# EAGLE design ControlUnit (EAGLE 5.12)

## Sheet 1 of 5
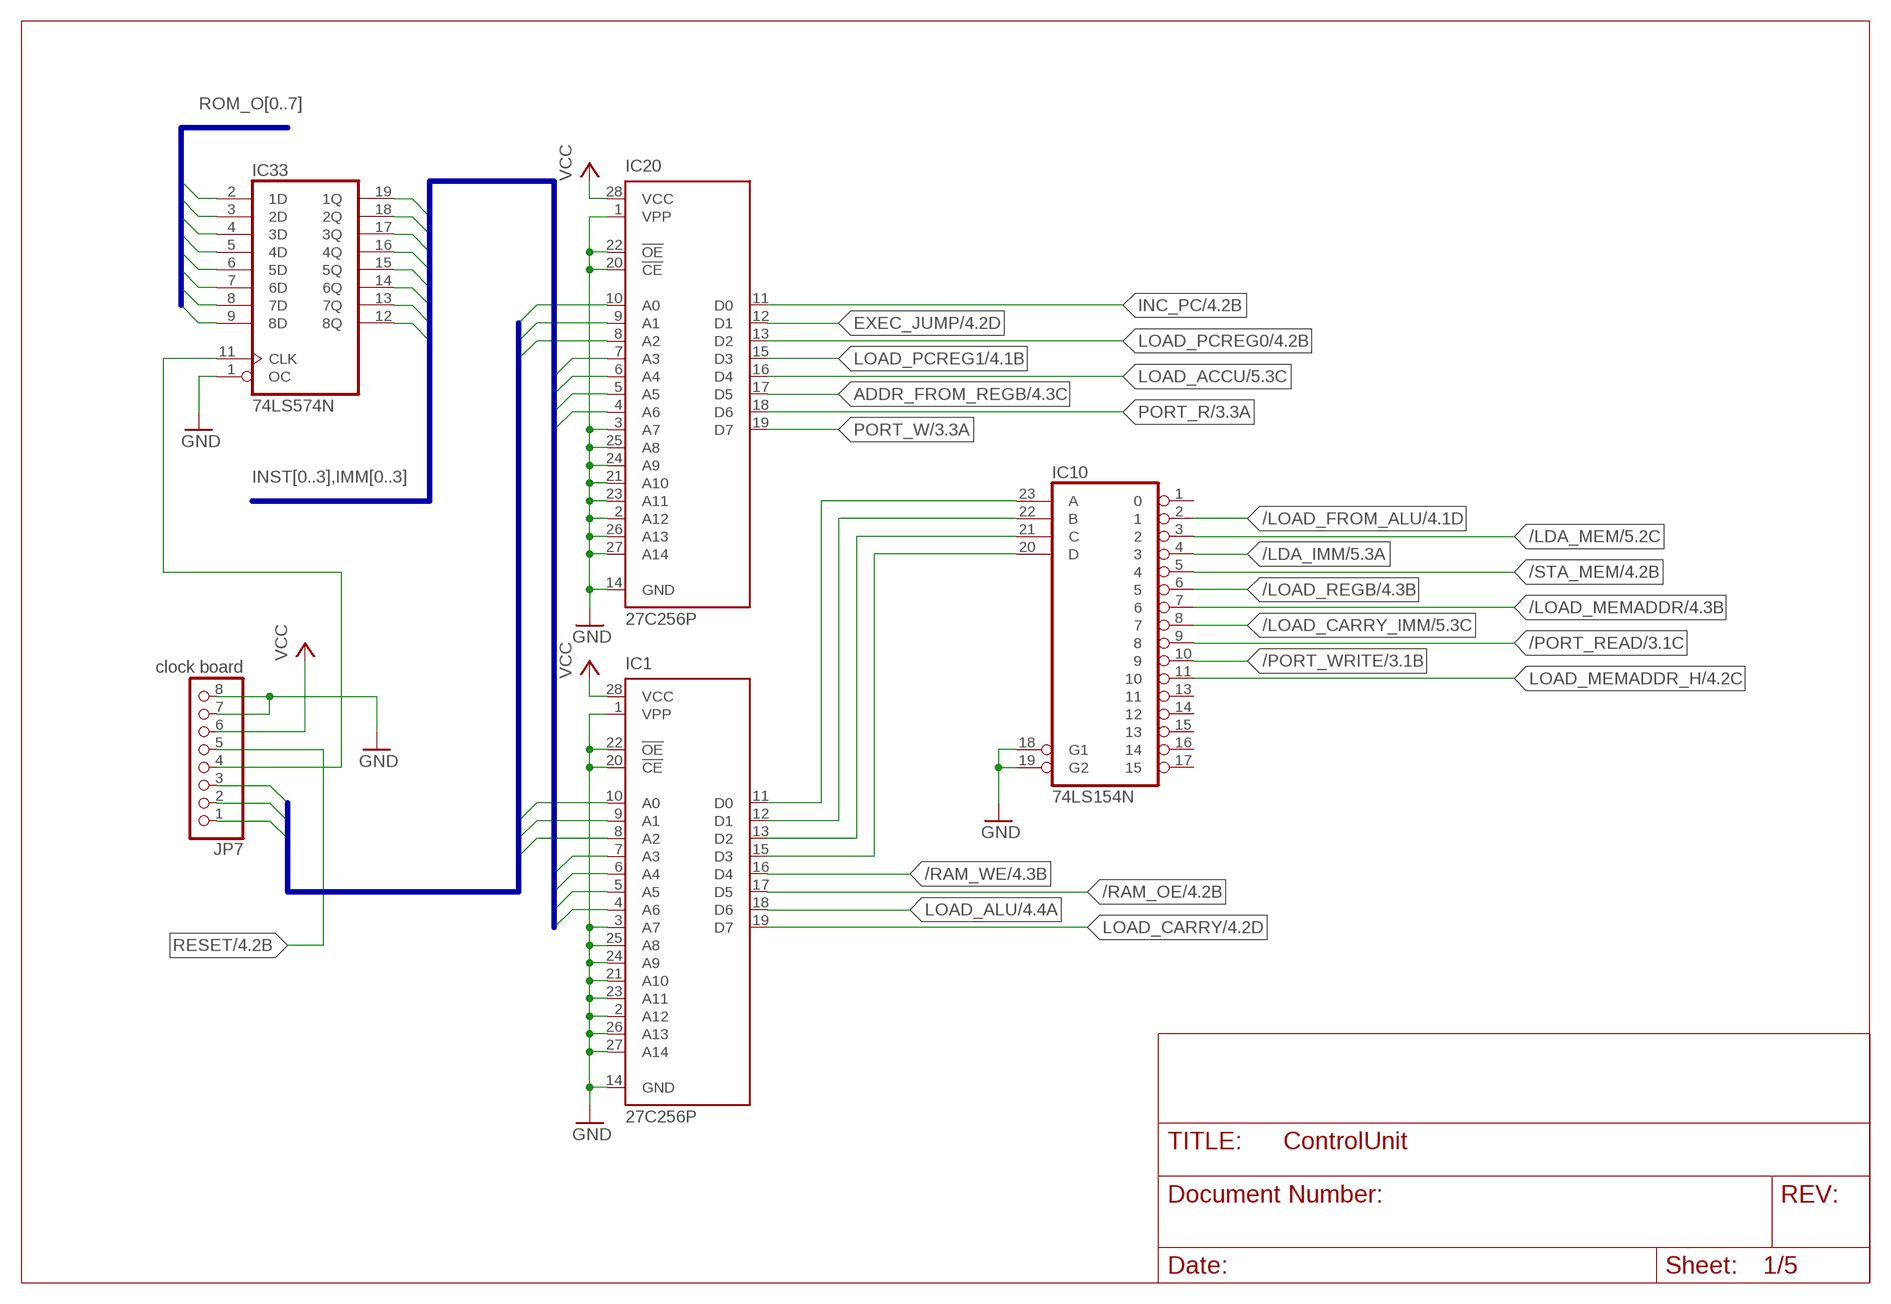
[diagram p0: schematic, sheet 1]

### Parts
IC1  27C256P  [DIL28-6]
IC10  74LS154N  74154N  [DIL24-6]
IC20  27C256P  [DIL28-6]
IC33  74LS574N  74AS574N  [DIL20]
JP7  clock board  PINHD-1X8  [1X08]

### Nets
/LDA_IMM: IC10.4 ; also sheet 5
/LDA_MEM: IC10.3 ; also sheet 5
/LOAD_CARRY_IMM: IC10.8 ; also sheet 5
/LOAD_FROM_ALU: IC10.2 ; also sheet 4,5
/LOAD_MEMADDR: IC10.7 ; also sheet 4
/LOAD_REGB: IC10.6 ; also sheet 4
/PORT_READ: IC10.9 ; also sheet 3
/PORT_WRITE: IC10.10 ; also sheet 3
/RAM_OE: IC1.17(D5) ; also sheet 4
/RAM_WE: IC1.16(D4) ; also sheet 4
/STA_MEM: IC10.5 ; also sheet 4
ADDR_FROM_REGB: IC20.17(D5) ; also sheet 4
EXEC_JUMP: IC20.12(D1) ; also sheet 4
GND: IC1.1(VPP) IC1.2(A12) IC1.3(A7) IC1.14(GND) IC1.20(!CE) IC1.21(A10) IC1.22(!OE) IC1.23(A11) IC1.24(A9) IC1.25(A8) IC1.26(A13) IC1.27(A14) IC10.18(G1) IC10.19(G2) IC20.1(VPP) IC20.2(A12) IC20.3(A7) IC20.14(GND) IC20.20(!CE) IC20.21(A10) IC20.22(!OE) IC20.23(A11) IC20.24(A9) IC20.25(A8) IC20.26(A13) IC20.27(A14) IC33.1(OC) JP7.7 JP7.8 ; also sheet 2,3,4,5
IC0: IC1.10(A0) IC20.10(A0) JP7.1
IC1: IC1.9(A1) IC20.9(A1) JP7.2
IC2: IC1.8(A2) IC20.8(A2) JP7.3
IMM0: IC33.15(5Q) ; also sheet 3,4,5
IMM1: IC33.14(6Q) ; also sheet 3,4,5
IMM2: IC33.13(7Q) ; also sheet 3,4,5
IMM3: IC33.12(8Q) ; also sheet 3,4,5
INC_PC: IC20.11(D0) ; also sheet 4
INST0: IC1.7(A3) IC20.7(A3) IC33.19(1Q)
INST1: IC1.6(A4) IC20.6(A4) IC33.18(2Q)
INST2: IC1.5(A5) IC20.5(A5) IC33.17(3Q)
INST3: IC1.4(A6) IC20.4(A6) IC33.16(4Q)
LOAD_ACCU: IC20.16(D4) ; also sheet 5
LOAD_ALU: IC1.18(D6) ; also sheet 4
LOAD_CARRY: IC1.19(D7) ; also sheet 4
LOAD_INST: IC33.11(CLK) JP7.4
LOAD_MEMADDR_H: IC10.11 ; also sheet 4
LOAD_PCREG0: IC20.13(D2) ; also sheet 4
LOAD_PCREG1: IC20.15(D3) ; also sheet 4
LOADREG0: IC1.11(D0) IC10.23(A)
LOADREG1: IC1.12(D1) IC10.22(B)
LOADREG2: IC1.13(D2) IC10.21(C)
LOADREG3: IC1.15(D3) IC10.20(D)
PORT_R: IC20.18(D6) ; also sheet 3
PORT_W: IC20.19(D7) ; also sheet 3
RESET: JP7.5 ; also sheet 4
ROM_O0: IC33.2(1D) ; also sheet 4
ROM_O1: IC33.3(2D) ; also sheet 4
ROM_O2: IC33.4(3D) ; also sheet 4
ROM_O3: IC33.5(4D) ; also sheet 4
ROM_O4: IC33.6(5D) ; also sheet 4
ROM_O5: IC33.7(6D) ; also sheet 4
ROM_O6: IC33.8(7D) ; also sheet 4
ROM_O7: IC33.9(8D) ; also sheet 4
VCC: IC1.28(VCC) IC20.28(VCC) JP7.6 ; also sheet 2,3,4
Unconnected: IC10.1 IC10.13 IC10.14 IC10.15 IC10.16 IC10.17

### Buses
ROM_O[0..7]
INST[0..3],IMM[0..3]
IC[0..2]

## Sheet 2 of 5
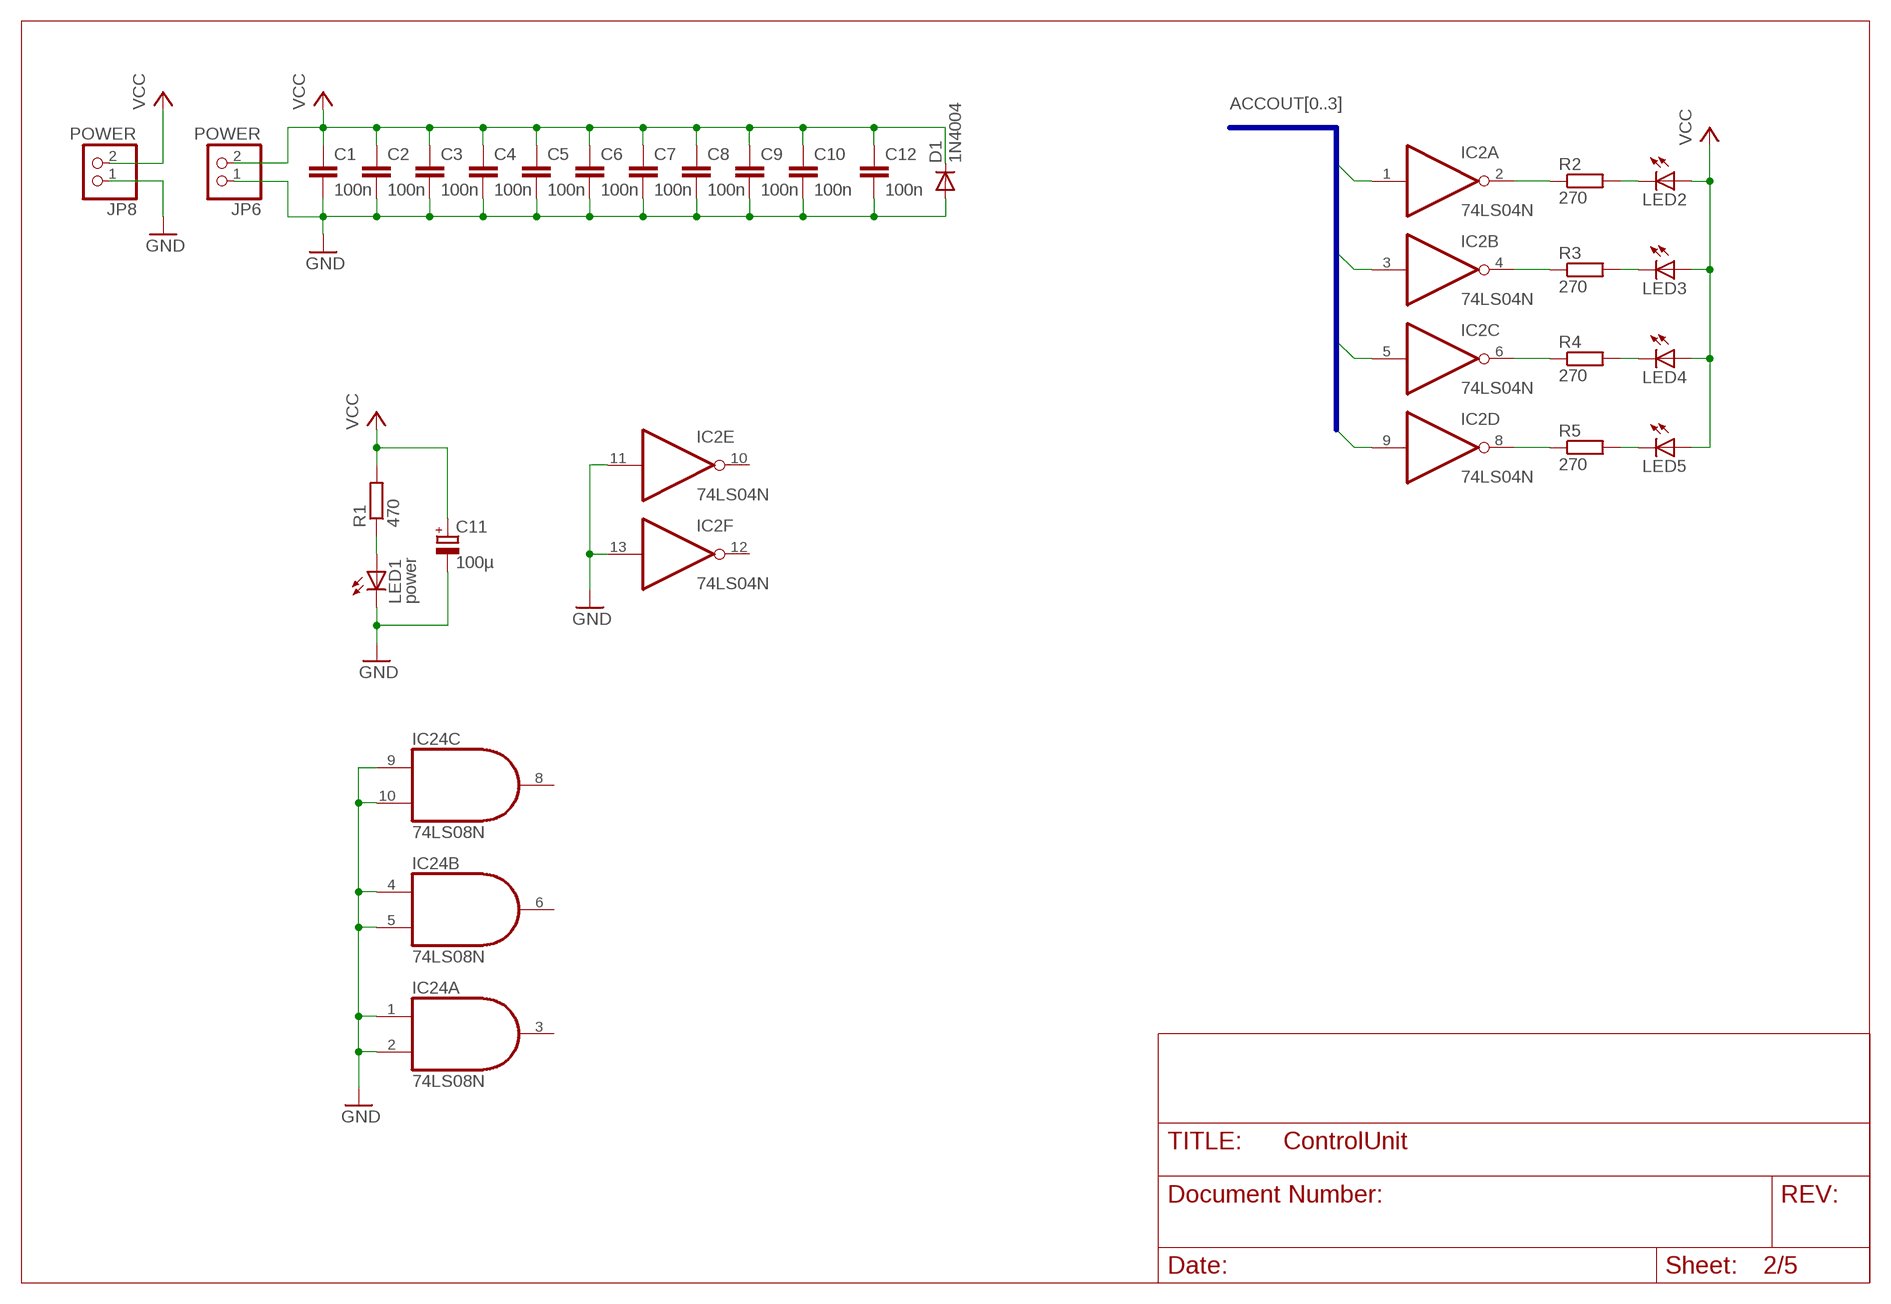
[diagram p1: schematic, sheet 2]

### Parts
C1  100n  C-EU050-025X075  [C050-025X075]
C2  100n  C-EU050-025X075  [C050-025X075]
C3  100n  C-EU050-025X075  [C050-025X075]
C4  100n  C-EU050-025X075  [C050-025X075]
C5  100n  C-EU050-025X075  [C050-025X075]
C6  100n  C-EU050-025X075  [C050-025X075]
C7  100n  C-EU050-025X075  [C050-025X075]
C8  100n  C-EU050-025X075  [C050-025X075]
C9  100n  C-EU050-025X075  [C050-025X075]
C10  100n  C-EU050-025X075  [C050-025X075]
C11  100µ  CPOL-EUE2.5-7  [E2,5-7]
C12  100n  C-EU050-025X075  [C050-025X075]
D1  1N4004  [DO41-10]
IC2  74LS04N  [DIL14]
IC24  74LS08N  [DIL14]
JP6  POWER  PINHD-1X2  [1X02]
JP8  POWER  PINHD-1X2  [1X02]
LED1  power  LED5MM  [LED5MM]
LED2  LED5MM  [LED5MM]
LED3  LED5MM  [LED5MM]
LED4  LED5MM  [LED5MM]
LED5  LED5MM  [LED5MM]
R1  470  R-EU_0207/10  [0207/10]
R2  270  R-EU_0207/7  [0207/7]
R3  270  R-EU_0207/7  [0207/7]
R4  270  R-EU_0207/7  [0207/7]
R5  270  R-EU_0207/7  [0207/7]

### Nets
ACCOUT0: IC2.1(A:I) ; also sheet 3,4,5
ACCOUT1: IC2.3(B:I) ; also sheet 3,4,5
ACCOUT2: IC2.5(C:I) ; also sheet 3,4,5
ACCOUT3: IC2.9(D:I) ; also sheet 3,4,5
GND: C1.2 C2.2 C3.2 C4.2 C5.2 C6.2 C7.2 C8.2 C9.2 C10.2 C11.- C12.2 D1.A IC2.11(E:I) IC2.13(F:I) IC24.1(A:I0) IC24.2(A:I1) IC24.4(B:I0) IC24.5(B:I1) IC24.9(C:I0) IC24.10(C:I1) JP6.1 JP8.1 LED1.K(C) ; also sheet 1,3,4,5
N$1: LED1.A R1.1
N$2: IC2.2(A:O) R2.1
N$3: IC2.4(B:O) R3.1
N$4: IC2.6(C:O) R4.1
N$5: IC2.8(D:O) R5.1
N$6: LED2.K(C) R2.2
N$7: LED3.K(C) R3.2
N$8: LED4.K(C) R4.2
N$9: LED5.K(C) R5.2
VCC: C1.1 C2.1 C3.1 C4.1 C5.1 C6.1 C7.1 C8.1 C9.1 C10.1 C11.+ C12.1 D1.C JP6.2 JP8.2 LED2.A LED3.A LED4.A LED5.A R1.2 ; also sheet 1,3,4
Unconnected: IC2.10(E:O) IC2.12(F:O) IC24.3(A:O) IC24.6(B:O) IC24.8(C:O)

### Buses
ACCOUT[0..3]

## Sheet 3 of 5
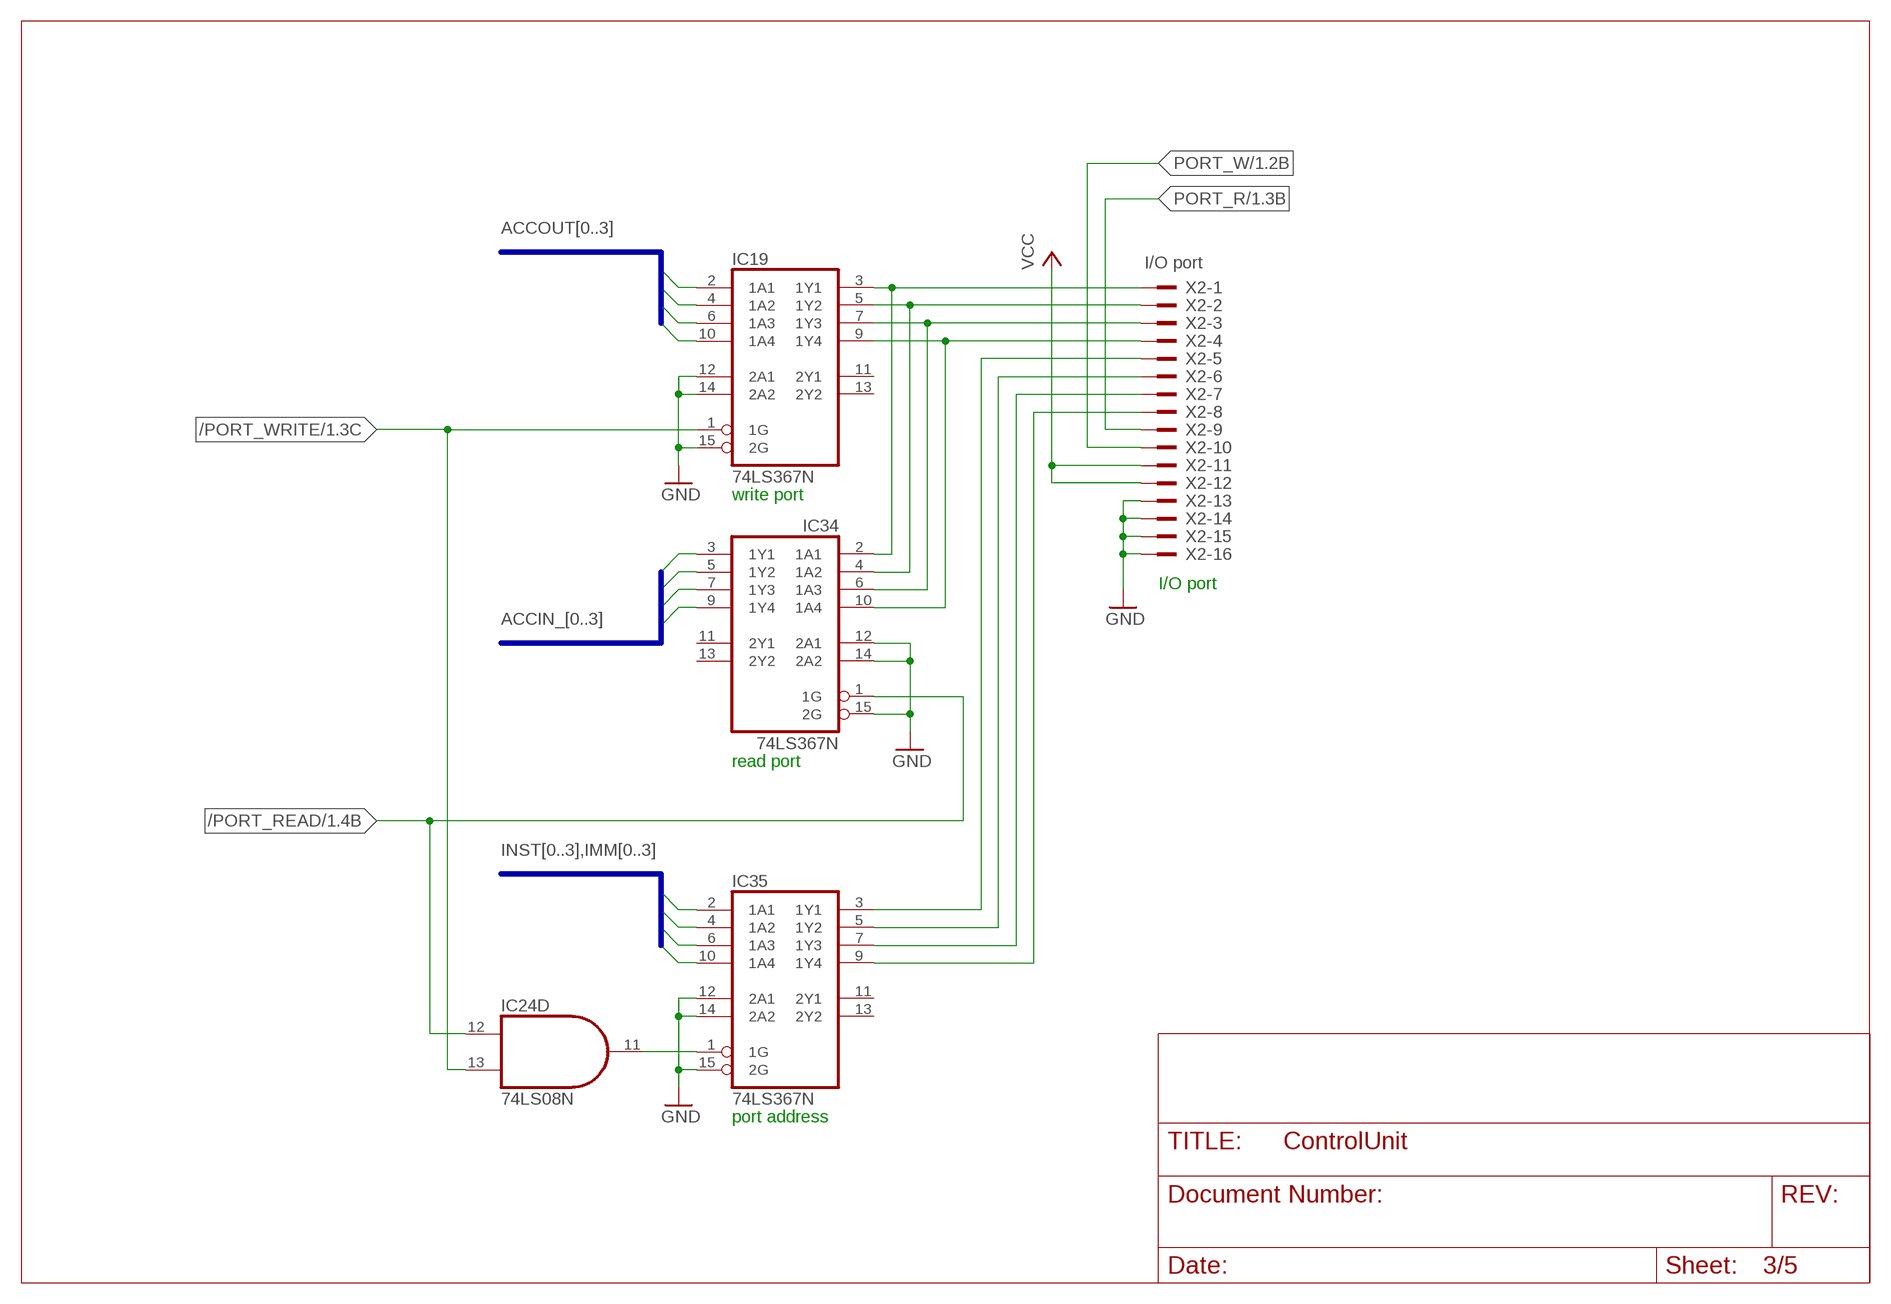
[diagram p2: schematic, sheet 3]

### Parts
IC19  74LS367N  74367N  [DIL16]
IC34  74LS367N  74367N  [DIL16]
IC35  74LS367N  74367N  [DIL16]
X2  I/O port  2516-  [PAK100/2500-16]

### Nets
/EN_PORT_ADDR: IC24.11(D:O) IC35.1(1G)
/PORT_READ: IC24.12(D:I0) IC34.1(1G) ; also sheet 1
/PORT_WRITE: IC19.1(1G) IC24.13(D:I1) ; also sheet 1
ACCIN_0: IC34.3(1Y1) ; also sheet 5
ACCIN_1: IC34.5(1Y2) ; also sheet 5
ACCIN_2: IC34.7(1Y3) ; also sheet 5
ACCIN_3: IC34.9(1Y4) ; also sheet 5
ACCOUT0: IC19.2(1A1) ; also sheet 2,4,5
ACCOUT1: IC19.4(1A2) ; also sheet 2,4,5
ACCOUT2: IC19.6(1A3) ; also sheet 2,4,5
ACCOUT3: IC19.10(1A4) ; also sheet 2,4,5
GND: IC19.12(2A1) IC19.14(2A2) IC19.15(2G) IC34.12(2A1) IC34.14(2A2) IC34.15(2G) IC35.12(2A1) IC35.14(2A2) IC35.15(2G) X2.13 X2.14 X2.15 X2.16 ; also sheet 1,2,4,5
IMM0: IC35.2(1A1) ; also sheet 1,4,5
IMM1: IC35.4(1A2) ; also sheet 1,4,5
IMM2: IC35.6(1A3) ; also sheet 1,4,5
IMM3: IC35.10(1A4) ; also sheet 1,4,5
PORT_ADDR0: IC35.3(1Y1) X2.5
PORT_ADDR1: IC35.5(1Y2) X2.6
PORT_ADDR2: IC35.7(1Y3) X2.7
PORT_ADDR3: IC35.9(1Y4) X2.8
PORT_IO0: IC19.3(1Y1) IC34.2(1A1) X2.1
PORT_IO1: IC19.5(1Y2) IC34.4(1A2) X2.2
PORT_IO2: IC19.7(1Y3) IC34.6(1A3) X2.3
PORT_IO3: IC19.9(1Y4) IC34.10(1A4) X2.4
PORT_R: X2.9 ; also sheet 1
PORT_W: X2.10 ; also sheet 1
VCC: X2.11 X2.12 ; also sheet 1,2,4
Unconnected: IC19.11(2Y1) IC19.13(2Y2) IC34.11(2Y1) IC34.13(2Y2) IC35.11(2Y1) IC35.13(2Y2)

### Buses
ACCIN_[0..3]
INST[0..3],IMM[0..3]
ACCOUT[0..3]

### Notes on the sheet
- write port
- I/O port
- read port
- port address

## Sheet 4 of 5
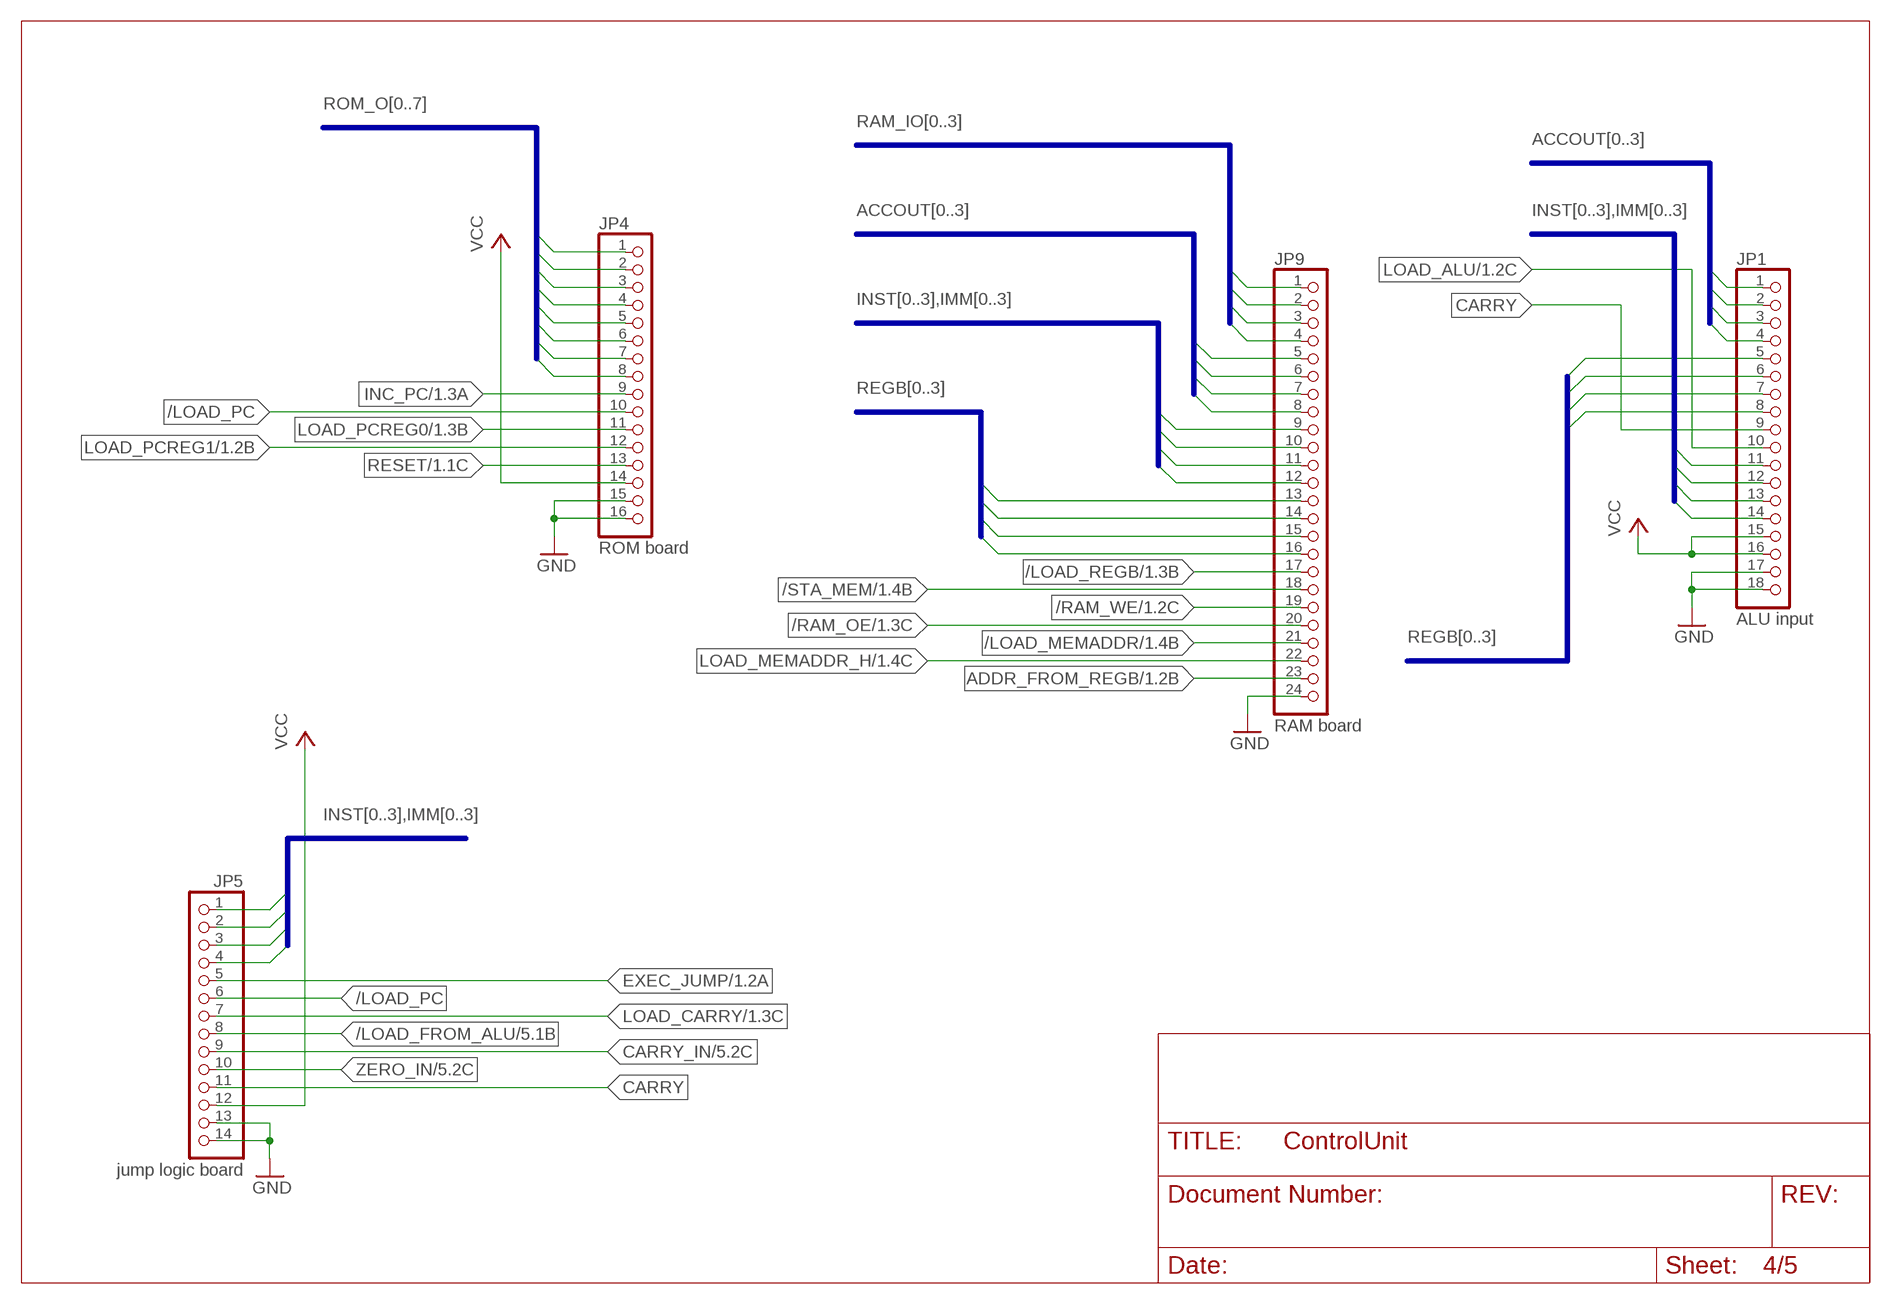
[diagram p3: schematic, sheet 4]

### Parts
JP1  ALU input  PINHD-1X18  [1X18]
JP4  ROM board  PINHD-1X16  [1X16]
JP5  jump logic board  PINHD-1X14  [1X14]
JP9  RAM board  PINHD-1X24  [1X24]

### Nets
/LOAD_FROM_ALU: JP5.8 ; also sheet 1,5
/LOAD_MEMADDR: JP9.21 ; also sheet 1
/LOAD_PC: JP4.10 JP5.6
/LOAD_REGB: JP9.17 ; also sheet 1
/RAM_OE: JP9.20 ; also sheet 1
/RAM_WE: JP9.19 ; also sheet 1
/STA_MEM: JP9.18 ; also sheet 1
ACCOUT0: JP1.1 JP9.5 ; also sheet 2,3,5
ACCOUT1: JP1.2 JP9.6 ; also sheet 2,3,5
ACCOUT2: JP1.3 JP9.7 ; also sheet 2,3,5
ACCOUT3: JP1.4 JP9.8 ; also sheet 2,3,5
ADDR_FROM_REGB: JP9.23 ; also sheet 1
CARRY: JP1.9 JP5.11
CARRY_IN: JP5.9 ; also sheet 5
EXEC_JUMP: JP5.5 ; also sheet 1
GND: JP1.17 JP1.18 JP4.15 JP4.16 JP5.13 JP5.14 JP9.24 ; also sheet 1,2,3,5
IMM0: JP1.11 JP5.4 JP9.9 ; also sheet 1,3,5
IMM1: JP1.12 JP5.3 JP9.10 ; also sheet 1,3,5
IMM2: JP1.13 JP5.2 JP9.11 ; also sheet 1,3,5
IMM3: JP1.14 JP5.1 JP9.12 ; also sheet 1,3,5
INC_PC: JP4.9 ; also sheet 1
LOAD_ALU: JP1.10 ; also sheet 1
LOAD_CARRY: JP5.7 ; also sheet 1
LOAD_MEMADDR_H: JP9.22 ; also sheet 1
LOAD_PCREG0: JP4.11 ; also sheet 1
LOAD_PCREG1: JP4.12 ; also sheet 1
RAM_IO0: JP9.1 ; also sheet 5
RAM_IO1: JP9.2 ; also sheet 5
RAM_IO2: JP9.3 ; also sheet 5
RAM_IO3: JP9.4 ; also sheet 5
REGB0: JP1.5 JP9.13
REGB1: JP1.6 JP9.14
REGB2: JP1.7 JP9.15
REGB3: JP1.8 JP9.16
RESET: JP4.13 ; also sheet 1
ROM_O0: JP4.1 ; also sheet 1
ROM_O1: JP4.2 ; also sheet 1
ROM_O2: JP4.3 ; also sheet 1
ROM_O3: JP4.4 ; also sheet 1
ROM_O4: JP4.5 ; also sheet 1
ROM_O5: JP4.6 ; also sheet 1
ROM_O6: JP4.7 ; also sheet 1
ROM_O7: JP4.8 ; also sheet 1
VCC: JP1.15 JP1.16 JP4.14 JP5.12 ; also sheet 1,2,3
ZERO_IN: JP5.10 ; also sheet 5

### Buses
INST[0..3],IMM[0..3]
ACCOUT[0..3]
REGB[0..3]
RAM_IO[0..3]
ROM_O[0..7]

## Sheet 5 of 5
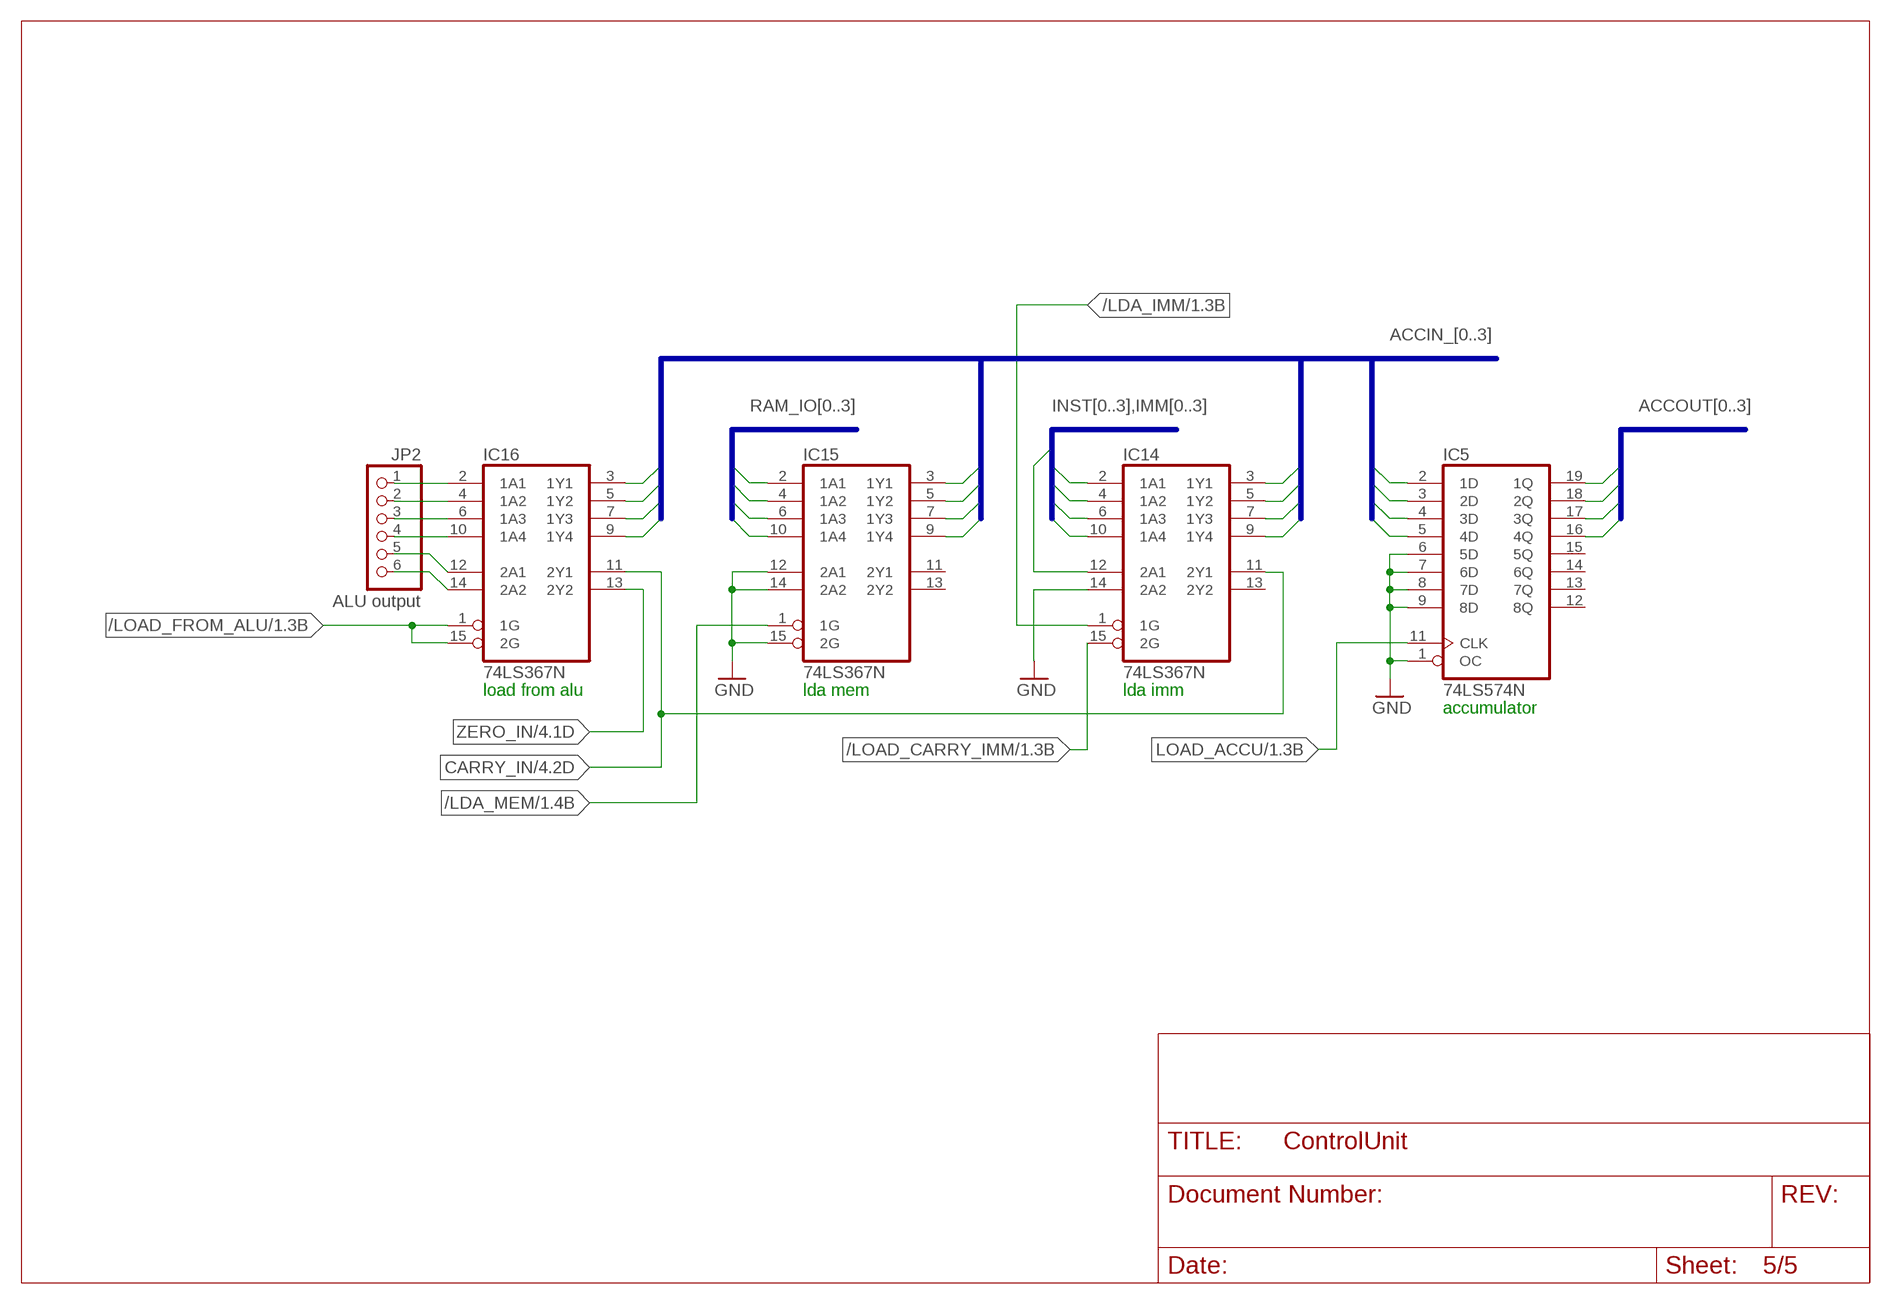
[diagram p4: schematic, sheet 5]

### Parts
IC5  74LS574N  74AS574N  [DIL20]
IC14  74LS367N  74367N  [DIL16]
IC15  74LS367N  74367N  [DIL16]
IC16  74LS367N  74367N  [DIL16]
JP2  ALU output  PINHD-1X6  [1X06]

### Nets
/LDA_IMM: IC14.1(1G) ; also sheet 1
/LDA_MEM: IC15.1(1G) ; also sheet 1
/LOAD_CARRY_IMM: IC14.15(2G) ; also sheet 1
/LOAD_FROM_ALU: IC16.1(1G) IC16.15(2G) ; also sheet 1,4
ACCIN_0: IC5.2(1D) IC14.3(1Y1) IC15.3(1Y1) IC16.3(1Y1) ; also sheet 3
ACCIN_1: IC5.3(2D) IC14.5(1Y2) IC15.5(1Y2) IC16.5(1Y2) ; also sheet 3
ACCIN_2: IC5.4(3D) IC14.7(1Y3) IC15.7(1Y3) IC16.7(1Y3) ; also sheet 3
ACCIN_3: IC5.5(4D) IC14.9(1Y4) IC15.9(1Y4) IC16.9(1Y4) ; also sheet 3
ACCOUT0: IC5.19(1Q) ; also sheet 2,3,4
ACCOUT1: IC5.18(2Q) ; also sheet 2,3,4
ACCOUT2: IC5.17(3Q) ; also sheet 2,3,4
ACCOUT3: IC5.16(4Q) ; also sheet 2,3,4
ALU_CARRY: IC16.12(2A1) JP2.5
ALU_O0: IC16.2(1A1) JP2.1
ALU_O1: IC16.4(1A2) JP2.2
ALU_O2: IC16.6(1A3) JP2.3
ALU_O3: IC16.10(1A4) JP2.4
ALU_ZERO: IC16.14(2A2) JP2.6
CARRY_IN: IC14.11(2Y1) IC16.11(2Y1) ; also sheet 4
GND: IC5.1(OC) IC5.6(5D) IC5.7(6D) IC5.8(7D) IC5.9(8D) IC14.14(2A2) IC15.12(2A1) IC15.14(2A2) IC15.15(2G) ; also sheet 1,2,3,4
IMM0: IC14.2(1A1) IC14.12(2A1) ; also sheet 1,3,4
IMM1: IC14.4(1A2) ; also sheet 1,3,4
IMM2: IC14.6(1A3) ; also sheet 1,3,4
IMM3: IC14.10(1A4) ; also sheet 1,3,4
LOAD_ACCU: IC5.11(CLK) ; also sheet 1
RAM_IO0: IC15.2(1A1) ; also sheet 4
RAM_IO1: IC15.4(1A2) ; also sheet 4
RAM_IO2: IC15.6(1A3) ; also sheet 4
RAM_IO3: IC15.10(1A4) ; also sheet 4
ZERO_IN: IC16.13(2Y2) ; also sheet 4
Unconnected: IC5.12(8Q) IC5.13(7Q) IC5.14(6Q) IC5.15(5Q) IC14.13(2Y2) IC15.11(2Y1) IC15.13(2Y2)

### Buses
ACCIN_[0..3]
RAM_IO[0..3]
ACCOUT[0..3]
INST[0..3],IMM[0..3]

### Notes on the sheet
- load from alu | lda mem | lda imm
- accumulator

## Power pins joined to a net without a drawn wire
GND: IC2.7(P:GND) IC5.10(GND) IC10.12(GND) IC14.8(GND) IC15.8(GND) IC16.8(GND) IC19.8(GND) IC24.7(P:GND) IC33.10(GND) IC34.8(GND) IC35.8(GND)
VCC: IC2.14(P:VCC) IC5.20(VCC) IC10.24(VCC) IC14.16(VCC) IC15.16(VCC) IC16.16(VCC) IC19.16(VCC) IC24.14(P:VCC) IC33.20(VCC) IC34.16(VCC) IC35.16(VCC)

## Library data of the parts
C1-C10 C12 = rcl:C-EU: CAPACITOR, European symbol
C11 = rcl:CPOL-EU: POLARIZED CAPACITOR, European symbol
D1 = diode:1N4004: DIODE general purpose rectifier, 1 A
IC1 IC20 = microchip:27*256: CMOS EPROM 256 K (32 K x 8), low voltage; MF: Arrow Electronics; MPN: M27C256B15F1; OC_FARNELL: 1125431; OC_NEWARK: 93K7335
IC2 = 74xx-eu:74*04: Hex INVERTER
IC5 IC33 = 74xx-us:74*574: 8-bit D type FLIP FLOP bus driver
IC10 = 74xx-us:74*154: 4-line to 16-line data SELECTOR/MULTIPLEXER
IC14-IC16 IC19 IC34 IC35 = 74xx-us:74*367: Hex BUS DRIVER, 3-state
IC24 = 74xx-us:74*08: Quad 2-input AND gate
JP1 = pinhead:PINHD-1X18: PIN HEADER
JP2 = pinhead:PINHD-1X6: PIN HEADER
JP4 = pinhead:PINHD-1X16: PIN HEADER
JP5 = pinhead:PINHD-1X14: PIN HEADER
JP6 JP8 = pinhead:PINHD-1X2: PIN HEADER
JP7 = pinhead:PINHD-1X8: PIN HEADER
JP9 = pinhead:PINHD-1X24: PIN HEADER
LED1-LED5 = led:LED: LED OSRAM: - CHIPLED LG R971, LG N971, LY N971, LG Q971, LY Q971, LO R971, LY R971 LH N974, LH R974 LS Q976, LO Q976, LY Q976 LO Q996 - Hyper CHIPLED LW Q18S LB Q993, LB Q99A, LB R99A - SideLED LS A670, LO A670, LY A670, LG A670, LP A670 LB A673, LV A673, LT A673, LW A673 LH A674 LY A675 LS A676, LA A676, LO A676, LY A676, LW A676 LS A679, LY A679, LG A679 - Hyper Micro SIDELED® LS Y876, LA Y876, LO Y876, LY Y876 LT Y87S - SmartLED LW L88C, LW L88S LB L89C, LB L89S, LG L890 LS L89K, LO L89K, LY L89K LS L896, LA L896, LO L896, LY L896 - TOPLED LS T670, LO T670, LY T670, LG T670, LP T670 LSG T670, LSP T670, LSY T670, LOP T670, LYG T670 LG T671, LOG T671, LSG T671 LB T673, LV T673, LT T673, LW T673 LH T674 LS T676, LA T676, LO T676, LY T676, LB T676, LH T676, LSB T676, LW T676 LB T67C, LV T67C, LT T67C, LS T67K, LO T67K, LY T67K, LW E67C LS E67B, LA E67B, LO E67B, LY E67B, LB E67C, LV E67C, LT E67C LW T67C LS T679, LY T679, LG T679 LS T770, LO T770, LY T770, LG T770, LP T770 LB T773, LV T773, LT T773, LW T773 LH T774 LS E675, LA E675, LY E675, LS T675 LS T776, LA T776, LO T776, LY T776, LB T776 LHGB T686 LT T68C, LB T68C - Hyper Mini TOPLED® LB M676 - Mini TOPLED Santana® LG M470 LS M47K, LO M47K, LY M47K Source: http://www.osram.convergy.de LUXEON: - LUMILED® LXK2-PW12-R00, LXK2-PW12-S00, LXK2-PW14-U00, LXK2-PW14-V00 LXK2-PM12-R00, LXK2-PM12-S00, LXK2-PM14-U00 LXK2-PE12-Q00, LXK2-PE12-R00, LXK2-PE12-S00, LXK2-PE14-T00, LXK2-PE14-U00 LXK2-PB12-K00, LXK2-PB12-L00, LXK2-PB12-M00, LXK2-PB14-N00, LXK2-PB14-P00, LXK2-PB14-Q00 LXK2-PR12-L00, LXK2-PR12-M00, LXK2-PR14-Q00, LXK2-PR14-R00 LXK2-PD12-Q00, LXK2-PD12-R00, LXK2-PD12-S00 LXK2-PH12-R00, LXK2-PH12-S00 LXK2-PL12-P00, LXK2-PL12-Q00, LXK2-PL12-R00 Source: www.luxeon.com KINGBRIGHT: KA-3528ASYC Source: www.kingbright.com
R1-R5 = rcl:R-EU_: RESISTOR, European symbol
X2 = con-3m:2516-: 3M (TM) Pak 100 4-Wall Header Source: 3M; OC_FARNELL: unknown; OC_NEWARK: unknown

## Board
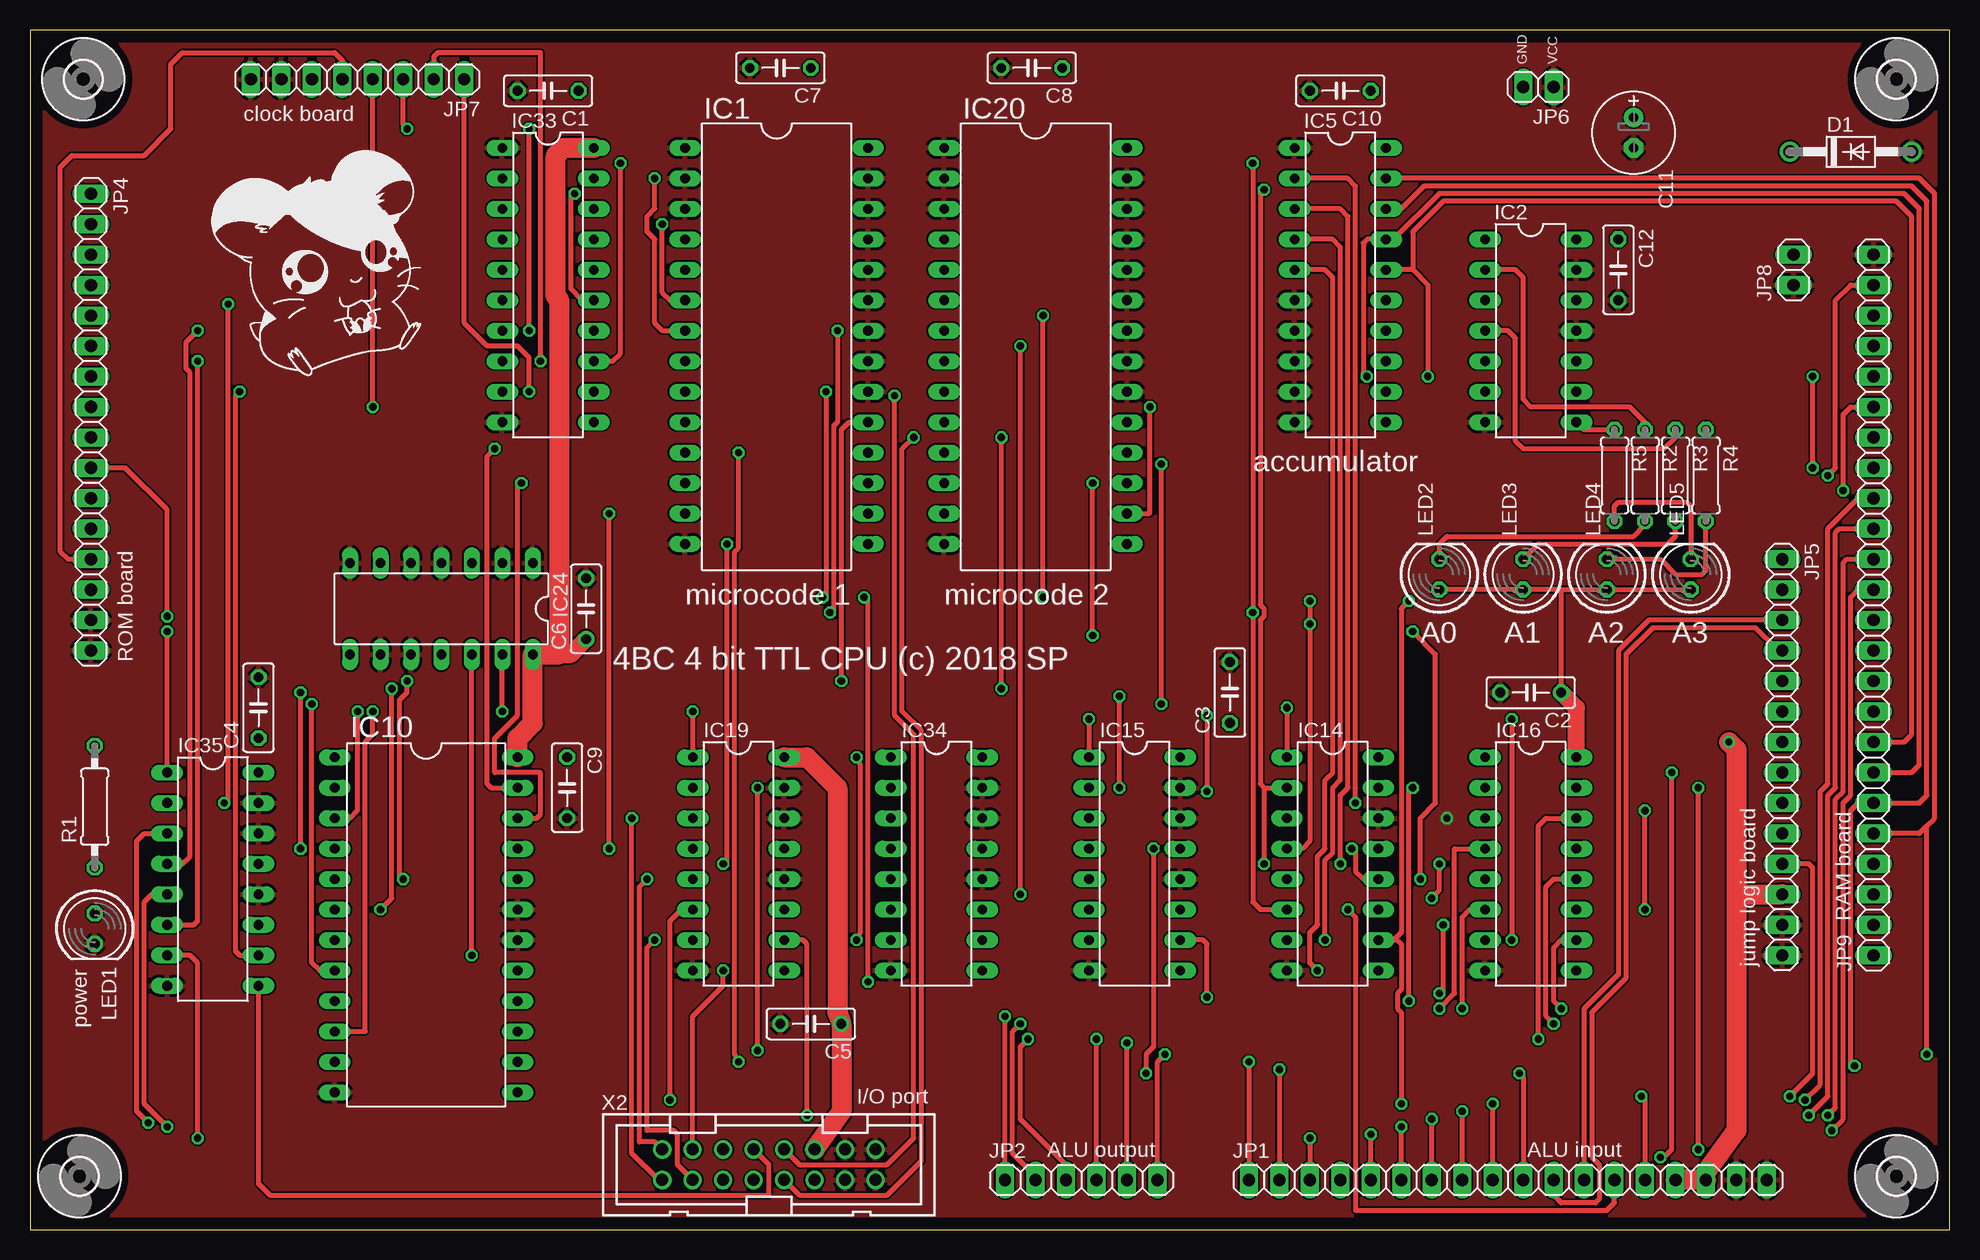
[diagram p5: board, top side]
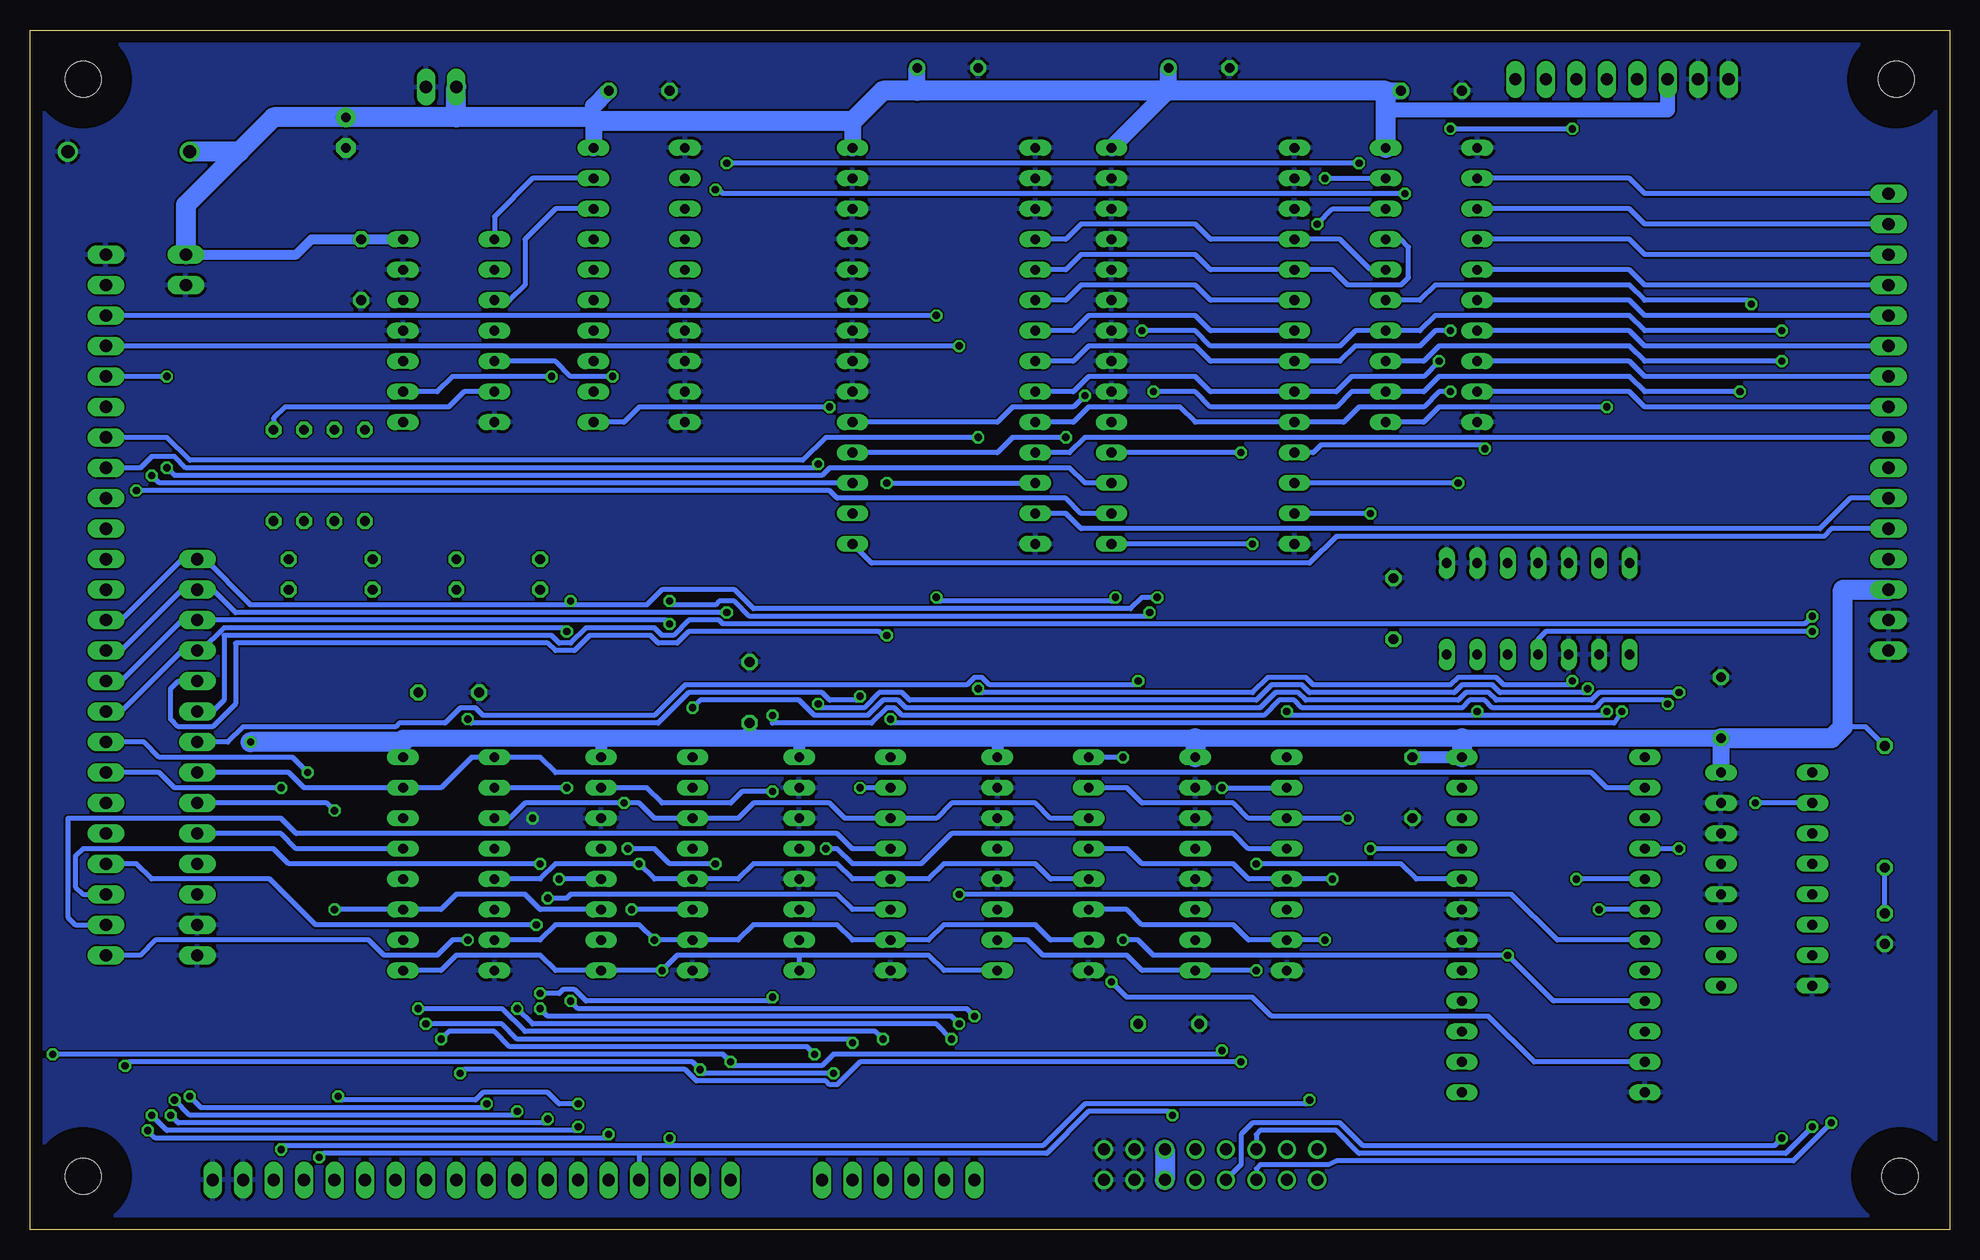
[diagram p6: board, bottom side, seen from below]

Size 160 x 100 mm. Coordinates in mm from the lower left corner, seen from the top.
Outline: 0,0 160,0 160,100 0,100 0,0
Copper layers (1*16): Top 0.035mm / dielectric 1.5mm / Bottom 0.035mm
Design rules "default *": minimum track width 10mil, minimum drill 16mil, track to track 6mil, track to pad 6mil, pad to pad 8mil, via to via 8mil, smd to smd 8mil, copper to edge 40mil, drill to drill 8mil, minimum pad ring 10mil, minimum via ring 8mil, stop-mask expansion 4mil, vias tented up to drill 0mil, thermal gap 10mil

### Footprints (pad centres in the part's own frame; a part is rotated, then mirrored left to right if it is on the bottom)
C050-025X075 = drill 0.813 octagon: 1 -2.54,0; 2 2.54,0
E2,5-7 = drill 0.813 pad 1.6 round: + -1.27,0 | drill 0.813 pad 1.6 octagon: - 1.27,0
DO41-10 = drill 1.118 round: A 5.08,0; C -5.08,0
DIL28-6 = drill 0.813 long: 1 -16.51,-7.62; 2 -13.97,-7.62; 3 -11.43,-7.62; 4 -8.89,-7.62; 5 -6.35,-7.62; 6 -3.81,-7.62; 7 -1.27,-7.62; 8 1.27,-7.62; 9 3.81,-7.62; 10 6.35,-7.62; 11 8.89,-7.62; 12 11.43,-7.62; 13 13.97,-7.62; 14 16.51,-7.62; 15 16.51,7.62; 16 13.97,7.62; 17 11.43,7.62; 18 8.89,7.62; 19 6.35,7.62; 20 3.81,7.62; 21 1.27,7.62; 22 -1.27,7.62; 23 -3.81,7.62; 24 -6.35,7.62; 25 -8.89,7.62; 26 -11.43,7.62; 27 -13.97,7.62; 28 -16.51,7.62
DIL14 = drill 0.813 long: 1 -7.62,-3.81; 2 -5.08,-3.81; 3 -2.54,-3.81; 4 0,-3.81; 5 2.54,-3.81; 6 5.08,-3.81; 7 7.62,-3.81; 8 7.62,3.81; 9 5.08,3.81; 10 2.54,3.81; 11 0,3.81; 12 -2.54,3.81; 13 -5.08,3.81; 14 -7.62,3.81
DIL20 = drill 0.813 long: 1 -11.43,-3.81; 2 -8.89,-3.81; 3 -6.35,-3.81; 4 -3.81,-3.81; 5 -1.27,-3.81; 6 1.27,-3.81; 7 3.81,-3.81; 8 6.35,-3.81; 9 8.89,-3.81; 10 11.43,-3.81; 11 11.43,3.81; 12 8.89,3.81; 13 6.35,3.81; 14 3.81,3.81; 15 1.27,3.81; 16 -1.27,3.81; 17 -3.81,3.81; 18 -6.35,3.81; 19 -8.89,3.81; 20 -11.43,3.81
DIL24-6 = drill 0.813 long: 1 -13.97,-7.62; 2 -11.43,-7.62; 3 -8.89,-7.62; 4 -6.35,-7.62; 5 -3.81,-7.62; 6 -1.27,-7.62; 7 1.27,-7.62; 8 3.81,-7.62; 9 6.35,-7.62; 10 8.89,-7.62; 11 11.43,-7.62; 12 13.97,-7.62; 13 13.97,7.62; 14 11.43,7.62; 15 8.89,7.62; 16 6.35,7.62; 17 3.81,7.62; 18 1.27,7.62; 19 -1.27,7.62; 20 -3.81,7.62; 21 -6.35,7.62; 22 -8.89,7.62; 23 -11.43,7.62; 24 -13.97,7.62
DIL16 = drill 0.813 long: 1 -8.89,-3.81; 2 -6.35,-3.81; 3 -3.81,-3.81; 4 -1.27,-3.81; 5 1.27,-3.81; 6 3.81,-3.81; 7 6.35,-3.81; 8 8.89,-3.81; 9 8.89,3.81; 10 6.35,3.81; 11 3.81,3.81; 12 1.27,3.81; 13 -1.27,3.81; 14 -3.81,3.81; 15 -6.35,3.81; 16 -8.89,3.81
1X18 = drill 1.016 long: 1 -21.59,0; 2 -19.05,0; 3 -16.51,0; 4 -13.97,0; 5 -11.43,0; 6 -8.89,0; 7 -6.35,0; 8 -3.81,0; 9 -1.27,0; 10 1.27,0; 11 3.81,0; 12 6.35,0; 13 8.89,0; 14 11.43,0; 15 13.97,0; 16 16.51,0; 17 19.05,0; 18 21.59,0
1X06 = drill 1.016 long: 1 -6.35,0; 2 -3.81,0; 3 -1.27,0; 4 1.27,0; 5 3.81,0; 6 6.35,0
1X16 = drill 1.016 long: 1 -19.05,0; 2 -16.51,0; 3 -13.97,0; 4 -11.43,0; 5 -8.89,0; 6 -6.35,0; 7 -3.81,0; 8 -1.27,0; 9 1.27,0; 10 3.81,0; 11 6.35,0; 12 8.89,0; 13 11.43,0; 14 13.97,0; 15 16.51,0; 16 19.05,0
1X14 = drill 1.016 long: 1 -16.51,0; 2 -13.97,0; 3 -11.43,0; 4 -8.89,0; 5 -6.35,0; 6 -3.81,0; 7 -1.27,0; 8 1.27,0; 9 3.81,0; 10 6.35,0; 11 8.89,0; 12 11.43,0; 13 13.97,0; 14 16.51,0
1X02 = drill 1.016 long: 1 -1.27,0; 2 1.27,0
1X08 = drill 1.016 long: 1 -8.89,0; 2 -6.35,0; 3 -3.81,0; 4 -1.27,0; 5 1.27,0; 6 3.81,0; 7 6.35,0; 8 8.89,0
1X24 = drill 1.016 long: 1 -29.21,0; 2 -26.67,0; 3 -24.13,0; 4 -21.59,0; 5 -19.05,0; 6 -16.51,0; 7 -13.97,0; 8 -11.43,0; 9 -8.89,0; 10 -6.35,0; 11 -3.81,0; 12 -1.27,0; 13 1.27,0; 14 3.81,0; 15 6.35,0; 16 8.89,0; 17 11.43,0; 18 13.97,0; 19 16.51,0; 20 19.05,0; 21 21.59,0; 22 24.13,0; 23 26.67,0; 24 29.21,0
LED5MM = drill 0.813 octagon: A -1.27,0; K 1.27,0
0207/10 = drill 0.813 octagon: 1 -5.08,0; 2 5.08,0
0207/7 = drill 0.813 octagon: 1 -3.81,0; 2 3.81,0
3,0 = hole 3: 0,0
PAK100/2500-16 = drill 1 pad 1.422 round: 1 -8.89,-1.27; 2 -8.89,1.27; 3 -6.35,-1.27; 4 -6.35,1.27; 5 -3.81,-1.27; 6 -3.81,1.27; 7 -1.27,-1.27; 8 -1.27,1.27; 9 1.27,-1.27; 10 1.27,1.27; 11 3.81,-1.27; 12 3.81,1.27; 13 6.35,-1.27; 14 6.35,1.27; 15 8.89,-1.27; 16 8.89,1.27

### Placement (x,y rotation side)
C1  43.18,94.93 180 top
C2  125.09,44.77 180 top
C3  100.01,44.77 90 top
C4  19.05,43.5 90 top
C5  65.09,17.14 180 top
C6  46.35,51.75 90 top
C7  62.55,96.84 180 top
C8  83.5,96.84 180 top
C9  44.77,36.83 270 top
C10  109.22,94.93 180 top
C11  133.67,91.44 270 top
C12  132.4,80.01 270 top
D1  151.76,89.85 0 top
IC1  62.23,73.66 270 top
IC2  125.09,74.93 270 top
IC5  109.22,78.74 270 top
IC10  33.02,25.4 270 top
IC14  108.58,30.48 270 top
IC15  92.08,30.48 270 top
IC16  125.09,30.48 270 top
IC19  59.05,30.48 270 top
IC20  83.82,73.66 270 top
IC24  34.29,51.75 180 top
IC33  43.18,78.74 270 top
IC34  75.56,30.48 270 top
IC35  15.24,29.21 270 top
JP1  123.19,4.13 0 top
JP2  87.63,4.13 0 top
JP4  5.08,67.31 270 top
JP5  146.05,39.37 270 top
JP6  125.73,95.25 180 top
JP7  27.3,95.89 180 top
JP8  147,80.01 90 top
JP9  153.67,52.07 90 top
LED1  5.4,25.08 270 top
LED2  117.47,54.61 90 top
LED3  124.46,54.61 90 top
LED4  131.44,54.61 90 top
LED5  138.43,54.61 90 top
R1  5.4,35.24 90 top
R2  134.62,62.87 270 top
R3  137.16,62.87 270 top
R4  139.7,62.87 270 top
R5  132.08,62.87 270 top
U$1  [3,0]  4.45,95.89 0 top
U$2  [3,0]  155.57,95.89 0 top
U$3  [3,0]  4.13,4.45 0 top
U$4  [3,0]  155.57,4.45 0 top
X2  61.59,5.4 0 top

### Tracks (layer width: path | path; a pad name or v marks a point on that pad's centre or on a via)
/EN_PORT_ADDR  (via drill 0.6)
  Top 0.406: IC35.1 v11.43,49.85
  Bottom 0.406: IC24.11 34.29,49.21 33.66,49.85 v11.43,49.85
/LDA_IMM  (via drill 0.6)
  Top 0.406: v104.78,43.5 IC14.1 | v22.54,31.75 v22.54,44.77
  Bottom 0.406: v104.78,43.5 104.14,44.13 95.89,44.13 94.61,42.86 90.17,42.86 88.9,44.13 87.63,44.13 87,43.5 57.47,43.5 56.2,44.77 54.29,44.77 53.66,44.13 40.96,44.13 40.32,44.77 38.42,44.77 37.78,44.13 29.84,44.13 29.21,44.77 v22.54,44.77 | v22.54,31.75 IC10.4
/LDA_MEM  (via drill 0.6)
  Top 0.406: v88.27,42.55 IC15.1 | v27.3,43.18 27.3,34.92 26.67,34.29 IC10.3
  Bottom 0.406: v27.3,43.18 27.94,42.23 88.27,42.23 v88.27,42.55
/LOAD_CARRY_IMM  (via drill 0.6)
  Top 0.406: v98.11,42.86 v98.11,36.51 | v23.5,43.81 23.5,22.23 24.13,21.59 IC10.8
  Bottom 0.406: IC14.15 108.58,36.83 107.31,35.56 101.6,35.56 100.65,36.51 v98.11,36.51 | v98.11,42.86 98.11,42.23 89.85,42.23 88.58,43.5 87.95,43.5 87.31,42.86 57.15,42.86 55.88,44.13 54.61,44.13 53.98,43.5 40.64,43.5 40.01,44.13 38.73,44.13 38.1,43.5 29.53,43.5 28.89,44.13 23.81,44.13 v23.5,43.81
/LOAD_FROM_ALU
  Bottom 0.406: IC10.2 28.57,36.83 29.84,38.1 116.2,38.1 117.47,39.37 IC16.1 123.19,39.37 125.73,36.83 IC16.15 137.16,36.83 138.43,38.1 JP5.8
/LOAD_MEMADDR  (via drill 0.6)
  Top 0.406: v82.55,27.94 v82.55,73.66
  Bottom 0.406: v82.55,73.66 JP9.21 | IC10.7 32.7,24.13 36.51,27.94 v82.55,27.94
/LOAD_PC  (via drill 0.6)
  Top 0.406: v11.43,51.12 11.43,60.01 7.94,63.5 JP4.10
  Bottom 0.406: JP5.6 144.78,43.18 143.83,44.13 143.83,49.53 116.52,49.53 115.89,48.9 114.94,48.9 113.67,50.16 107.95,50.16 107.31,49.53 106.36,49.53 105.09,50.8 102.55,50.8 102.23,50.48 12.06,50.48 v11.43,51.12
/LOAD_REGB  (via drill 0.6)
  Top 0.406: v94.3,43.81 v94.3,63.82 | v30.16,45.09 30.16,27.62 v29.21,26.67
  Bottom 0.406: JP9.17 150.81,63.5 149.86,64.45 147.96,64.45 147,63.5 94.61,63.5 v94.3,63.82 | v94.3,43.81 94.3,43.5 90.49,43.5 89.22,44.77 87.31,44.77 86.68,44.13 57.78,44.13 56.52,45.4 53.98,45.4 53.34,44.77 41.27,44.77 40.64,45.4 38.1,45.4 37.47,44.77 30.48,44.77 v30.16,45.09 | IC10.6 v29.21,26.67
/PORT_READ  (via drill 0.6)
  Top 0.406: v36.83,22.86 IC24.12 | v68.9,39.37 69.22,38.73 69.22,24.77 v68.9,24.13
  Bottom 0.406: IC10.9 33.02,19.05 v36.83,22.86 66.36,22.86 67.63,24.13 v68.9,24.13 | v68.9,39.37 IC34.1
/PORT_WRITE  (via drill 0.6)
  Top 0.406: v55.24,43.18 IC19.1 | v39.37,43.18 IC24.13 | v28.57,43.18 28.57,41.27 27.94,40.64 27.94,16.51 IC10.10
  Bottom 0.406: v55.24,43.18 55.24,42.86 39.37,42.86 | 39.37,42.86 v39.37,43.18 | 39.37,42.86 28.57,42.86 v28.57,43.18
/RAM_OE  (via drill 0.6)
  Top 0.406: v148.59,63.5 v148.59,71.12
  Bottom 0.406: IC1.17 72.07,62.23 73.34,63.5 93.34,63.5 93.98,62.87 147.96,62.87 v148.59,63.5 | v148.59,71.12 JP9.20
/RAM_WE  (via drill 0.6)
  Top 0.406: v151.13,61.59 151.13,67.94 151.76,68.58 JP9.19
  Bottom 0.406: IC1.16 72.39,59.69 73.66,60.96 92.71,60.96 93.34,61.59 v151.13,61.59
/STA_MEM  (via drill 0.6)
  Top 0.406: v80.96,45.09 v80.96,66.04 | v31.11,29.21 30.8,29.53 30.8,44.13 31.43,44.77 v31.43,45.72
  Bottom 0.406: JP9.18 148.59,66.04 146.69,64.14 95.57,64.14 93.66,66.04 v80.96,66.04 | v80.96,45.09 80.64,44.77 58.1,44.77 56.83,46.04 53.66,46.04 53.02,45.4 41.59,45.4 40.96,46.04 37.78,46.04 37.15,45.4 31.43,45.4 v31.43,45.72 | IC10.5 v31.11,29.21
ACCIN_0  (via drill 0.6)
  Top 0.406: IC5.2 109.86,87.63 110.49,87 v110.49,35.56
  Bottom 0.406: IC34.3 74.93,34.29 76.2,35.56 83.19,35.56 84.45,34.29 IC15.3 92.08,34.29 93.34,35.56 99.69,35.56 100.97,34.29 IC14.3 107.95,34.29 109.22,35.56 v110.49,35.56 118.75,35.56 120.02,34.29 IC16.3
ACCIN_1  (via drill 0.6)
  Top 0.406: IC5.3 109.22,85.09 109.86,84.45 109.86,36.83 109.22,36.2 v109.22,30.48
  Bottom 0.406: IC34.5 74.93,29.21 76.2,30.48 83.82,30.48 85.09,29.21 IC15.5 91.44,29.21 92.71,30.48 99.69,30.48 100.97,29.21 IC14.5 107.95,29.21 v109.22,30.48 116.2,30.48 117.47,29.21 IC16.5
ACCIN_2  (via drill 0.6)
  Top 0.406: IC5.4 108.58,82.55 109.22,81.92 109.22,37.47 108.58,36.83 108.58,31.43 107.95,30.8 v107.95,24.13
  Bottom 0.406: IC16.7 117.47,24.13 116.2,25.4 109.22,25.4 v107.95,24.13 IC14.7 100.97,24.13 99.69,25.4 92.71,25.4 91.44,24.13 IC15.7 85.09,24.13 83.82,25.4 76.2,25.4 74.93,24.13 IC34.7
ACCIN_3  (via drill 0.6)
  Top 0.406: IC5.5 107.95,80.01 108.58,79.38 108.58,38.1 107.95,37.47 107.95,31.75 107.31,31.11 107.31,25.4 106.68,24.77 106.68,22.23 v107.31,21.59
  Bottom 0.406: IC16.9 125.73,21.59 124.46,22.86 117.47,22.86 116.2,21.59 IC14.9 v107.31,21.59 106.05,22.86 95.89,22.86 | IC34.9 83.82,21.59 85.09,22.86 95.89,22.86 | 95.89,22.86 IC15.9
ACCOUT0  (via drill 0.6)
  Top 0.406: IC5.19 157.48,87.63 158.75,86.36 158.75,34.29 158.12,33.66 | 158.12,33.66 157.48,33.02 JP9.5 | v101.6,13.97 JP1.1 | v158.12,14.61 158.12,33.66 | v60.64,14.92 v60.64,36.83
  Bottom 0.406: v158.12,14.61 102.23,14.61 v101.6,13.97 101.28,13.65 93.98,13.65 93.03,14.61 60.96,14.61 v60.64,14.92 | v60.64,36.83 IC19.2 | IC2.1 121.28,84.45 118.11,87.63 IC5.19
ACCOUT1  (via drill 0.6)
  Top 0.406: IC5.18 114.3,85.09 116.2,87 156.84,87 158.12,85.72 158.12,36.2 157.48,35.56 JP9.6 152.4,35.56 151.76,34.92 151.76,13.97 v152.08,13.65 | v104.14,13.34 JP1.2 | v93.66,31.75 93.66,15.24 93.03,14.61 v93.03,13.02
  Bottom 0.406: v152.08,13.65 151.76,13.97 104.78,13.97 v104.14,13.34 103.82,13.02 v93.03,13.02 | IC19.4 58.42,31.75 59.69,33.02 83.19,33.02 85.72,30.48 91.44,30.48 92.71,31.75 v93.66,31.75 | IC2.3 120.02,77.47 118.75,78.74 118.75,82.55 116.2,85.09 IC5.18
ACCOUT2  (via drill 0.6)
  Top 0.406: JP9.7 156.84,38.1 157.48,38.73 157.48,85.09 156.21,86.36 117.47,86.36 113.67,82.55 IC5.17 111.44,82.55 111.12,82.23 111.12,71.44 v111.44,71.12 | v139.06,6.67 v139.06,36.83 | v106.68,7.62 JP1.3 | v53.34,10.79 53.34,25.72 54.29,26.67 IC19.6
  Bottom 0.406: JP9.7 149.22,38.1 147.96,36.83 v139.06,36.83 | v139.06,6.67 138.75,6.99 106.68,6.99 | 106.68,6.99 v106.68,7.62 | 106.68,6.99 75.56,6.99 72.07,10.48 53.66,10.48 v53.34,10.79 | IC2.5 116.2,72.39 114.94,71.12 v111.44,71.12
ACCOUT3  (via drill 0.6)
  Top 0.406: 115.25,80.01 115.25,83.19 117.79,85.72 155.57,85.72 156.84,84.45 156.84,41.27 156.21,40.64 JP9.8 | v135.89,6.03 136.21,6.03 136.84,6.67 v136.84,38.1 | v64.77,9.53 64.77,23.81 64.45,24.13 IC19.10 | v116.52,71.12 116.52,78.74 115.25,80.01 | 115.25,80.01 IC5.16
  Bottom 0.406: JP9.8 150.5,40.64 149.22,39.37 138.11,39.37 v136.84,38.1 | v135.89,6.03 135.57,6.35 109.22,6.35 | 109.22,6.35 JP1.4 | 109.22,6.35 75.25,6.35 71.75,9.84 65.09,9.84 v64.77,9.53 | IC2.9 126.05,69.85 124.78,71.12 v116.52,71.12
ADDR_FROM_REGB  (via drill 0.6)
  Top 0.406: JP9.23 151.76,78.74 150.5,77.47 150.5,63.5 v149.86,62.87
  Bottom 0.406: v149.86,62.87 149.22,62.23 IC20.17
ALU_CARRY  (via drill 0.6)
  Top 0.406: IC16.12 127,29.21 126.36,28.57 126.36,17.78 v127,17.14 | JP2.5 v91.44,15.56
  Bottom 0.406: v127,17.14 120.65,17.14 119.38,15.88 91.76,15.88 v91.44,15.56
ALU_O0  (via drill 0.6)
  Top 0.406: v115.25,36.83 114.94,36.51 v114.94,19.05 | JP2.1 v81.28,17.78
  Bottom 0.406: v115.25,36.83 IC16.2 | v114.94,19.05 114.3,18.41 81.92,18.41 v81.28,17.78
ALU_O1  (via drill 0.6)
  Top 0.406: JP2.2 83.82,4.45 81.92,6.35 81.92,16.51 v82.55,17.14 | v117.47,18.41 118.75,19.68 118.75,31.75 IC16.4
  Bottom 0.406: v82.55,17.14 83.19,17.78 116.84,17.78 v117.47,18.41
ALU_O2  (via drill 0.6)
  Top 0.406: JP2.3 86.36,5.4 82.55,9.21 82.55,15.24 v83.19,15.88 | v119.38,18.41 119.38,26.04 120.02,26.67 IC16.6
  Bottom 0.406: v83.19,15.88 84.45,17.14 118.11,17.14 v119.38,18.41
ALU_O3  (via drill 0.6)
  Top 0.406: JP2.4 v88.9,15.88 | v127.64,18.41 127,19.05 127,23.5 127.64,24.13 IC16.10
  Bottom 0.406: v88.9,15.88 89.53,16.51 118.75,16.51 120.65,18.41 v127.64,18.41
ALU_ZERO  (via drill 0.6)
  Top 0.406: JP2.6 93.98,13.97 v94.61,14.61 | v125.73,15.88 125.73,33.66 126.36,34.29 IC16.14
  Bottom 0.406: v94.61,14.61 95.25,15.24 120.02,15.24 121.28,16.51 125.09,16.51 v125.73,15.88
CARRY  (via drill 0.6)
  Top 0.406: JP1.9 v121.92,10.48 | v146.69,11.11 148.59,13.02 148.59,30.16 148.27,30.48 JP5.11
  Bottom 0.406: v121.92,10.48 122.24,10.16 145.73,10.16 v146.69,11.11
CARRY_IN  (via drill 0.6)
  Top 0.406: v134.62,26.67 v134.62,34.92
  Bottom 0.406: IC14.11 117.47,26.67 118.75,27.94 124.46,27.94 125.73,26.67 IC16.11 v134.62,26.67 | v134.62,34.92 135.25,35.56 JP5.9
EXEC_JUMP  (via drill 0.6)
  Top 0.406: v88.58,49.53 v88.58,62.23
  Bottom 0.406: v88.58,62.23 IC20.12 | v88.58,49.53 88.9,49.53 89.22,49.85 105.09,49.85 106.05,48.9 107.63,48.9 108.27,49.53 113.35,49.53 114.62,48.26 116.2,48.26 116.84,48.9 142.88,48.9 142.88,43.81 144.78,41.91 147.64,41.91 148.27,42.55 148.27,45.09 147.64,45.72 JP5.5
GND  (via drill 0.6)
  other vias: 118.11,34.29
  pour Top: 0,100.33 160.02,100.33 160.02,0 0,0
  pour Bottom: 0,100.33 160.02,100.33 160.02,0 0,0
IC0  (via drill 0.6)
  Top 0.406: v41.59,69.85 41.59,72.71 40.64,73.66 38.1,73.66 36.2,75.56 JP7.1
  Bottom 0.406: IC20.10 73.03,67.31 71.75,68.58 64.14,68.58 62.87,67.31 IC1.10 50.48,67.31 49.21,68.58 43.81,68.58 42.55,69.85 v41.59,69.85
IC1  (via drill 0.6)
  Top 0.406: v42.55,72.39 42.55,98.11 33.97,98.11 33.66,97.79 JP7.2
  Bottom 0.406: IC20.9 73.03,69.85 71.75,71.12 62.87,71.12 61.59,69.85 IC1.9 51.12,69.85 49.85,71.12 43.81,71.12 v42.55,72.39
IC2  (via drill 0.6)
  Top 0.406: v41.59,74.93 v41.59,91.76 | JP7.3 31.11,92.08 v31.43,91.76
  Bottom 0.406: IC20.8 73.03,72.39 71.75,73.66 62.87,73.66 61.59,72.39 IC1.8 50.8,72.39 49.53,73.66 44.13,73.66 42.86,74.93 v41.59,74.93 | v41.59,91.76 v31.43,91.76
IMM0  (via drill 0.6)
  Top 0.406: v110.17,31.75 110.49,31.43 110.49,29.84 111.12,29.21 IC14.12 | 102.87,36.83 v102.87,30.48 | v115.89,29.21 115.89,34.29 117.16,35.56 117.16,47.94 v115.25,49.85 | v16.51,77.15 16.51,35.88 v16.19,35.56 | 102.87,36.83 IC14.2 | v102.87,86.68 102.55,86.36 102.55,52.07 102.87,51.75 102.87,51.12 102.55,50.8 102.55,37.15 102.87,36.83 | v45.4,86.36 45.09,86.04 45.09,78.42 46.04,77.47 IC33.15 | JP1.11 127,2.86 127.64,2.22 130.49,2.22 130.81,2.54 130.81,5.4 130.18,6.03 130.18,18.1 133.03,20.95 133.03,47.94 135.25,50.16 143.83,50.16 145.57,48.42 145.89,48.42 JP5.4
  Bottom 0.406: JP9.9 152.4,43.18 147.32,48.26 JP5.4 145.73,48.26 143.83,50.16 115.57,50.16 v115.25,49.85 | v110.17,31.75 107.95,31.75 106.68,30.48 v102.87,30.48 | IC33.15 44.13,77.47 42.86,78.74 26.67,78.74 25.4,77.47 16.83,77.47 v16.51,77.15 | IC35.2 v16.19,35.56 | v102.87,86.68 102.55,86.68 102.23,86.36 v45.4,86.36 | IC14.12 v115.89,29.21
IMM1  (via drill 0.6)
  Top 0.406: IC14.4 106.05,31.75 106.68,32.38 v106.68,50.48 v106.68,52.39 | v13.97,74.93 13.02,73.98 13.02,71.75 13.34,71.44 13.34,31.11 12.7,30.48 IC35.4 | v67.31,74.93 67.31,67.31 66.99,66.99 66.99,51.75 v66.67,51.44 | JP1.12 129.54,18.41 132.4,21.27 132.4,48.26 134.94,50.8 JP5.3
  Bottom 0.406: JP9.10 152.4,45.72 147.32,50.8 JP5.3 107,50.8 v106.68,50.48 | v13.97,74.93 25.4,74.93 26.67,76.2 42.86,76.2 44.13,74.93 IC33.14 49.53,74.93 50.8,73.66 61.59,73.66 62.87,74.93 v67.31,74.93 | v66.67,51.44 66.99,51.12 100.01,51.12 101.28,52.39 102.55,52.39 102.87,52.07 106.36,52.07 v106.68,52.39
IMM2  (via drill 0.6)
  Top 0.406: v109.86,26.67 110.49,26.04 110.49,1.59 131.44,1.59 132.08,2.22 JP1.13 | IC14.6 102.55,26.67 101.92,27.3 v101.92,51.44 v101.92,88.9 | IC35.6 13.65,25.4 13.97,25.72 v13.97,72.39 | v49.21,88.9 49.21,73.03 48.58,72.39 IC33.13
  Bottom 0.406: JP9.11 152.4,48.26 147.32,53.34 JP5.2 144.78,53.34 142.88,51.44 v101.92,51.44 | IC14.6 v109.86,26.67 | v13.97,72.39 25.4,72.39 26.67,73.66 42.55,73.66 43.81,72.39 IC33.13 | v49.21,88.9 v101.92,88.9
IMM3  (via drill 0.6)
  Top 0.406: v114.94,52.39 114.3,51.75 114.3,24.77 113.82,24.29 | 113.82,24.29 113.67,24.13 IC14.10 | JP1.14 134.62,10.79 v134.3,11.11 | v114.3,10.48 114.3,18.1 113.98,18.41 113.98,19.68 114.3,20 114.3,23.81 113.82,24.29 | v17.46,69.85 17.14,69.53 17.14,23.18 17.46,22.86 IC35.10 | v66.36,69.85 66.36,53.02 v66.04,52.7
  Bottom 0.406: JP9.12 152.4,50.8 147.32,55.88 JP5.1 145.41,55.88 141.6,52.07 115.25,52.07 v114.94,52.39 114.94,52.07 108.58,52.07 107.31,53.34 101.28,53.34 99.69,51.75 68.26,51.75 67.31,52.7 v66.04,52.7 | v134.3,11.11 133.99,10.79 122.87,10.79 122.24,11.43 116.84,11.43 115.89,10.48 v114.3,10.48 | v17.46,69.85 25.4,69.85 26.67,71.12 42.55,71.12 43.81,69.85 IC33.12 49.85,69.85 51.12,68.58 61.59,68.58 62.87,69.85 v66.36,69.85
INC_PC
  Bottom 0.406: IC20.11 73.34,64.77 72.07,66.04 JP4.9
INST0  (via drill 0.6)
  Top 0.406: v52.07,87.63 52.07,85.09 51.44,84.45 51.44,83.19 52.07,82.55 52.07,75.56 52.7,74.93 IC1.7
  Bottom 0.406: IC1.7 61.59,74.93 62.87,76.2 71.75,76.2 73.03,74.93 IC20.7 | v52.07,87.63 IC33.19
INST1  (via drill 0.6)
  Top 0.406: v52.7,83.82 52.7,78.11 53.34,77.47 IC1.6
  Bottom 0.406: IC33.18 51.44,85.09 v52.7,83.82 | IC1.6 61.59,77.47 62.87,78.74 72.39,78.74 73.66,77.47 IC20.6
INST2
  Bottom 0.406: IC33.17 45.72,82.55 45.09,81.92 45.09,79.38 45.72,78.74 50.16,78.74 51.44,80.01 IC1.5 61.59,80.01 62.87,81.28 72.39,81.28 73.66,80.01 IC20.5
INST3
  Bottom 0.406: IC33.16 48.26,80.01 50.8,82.55 IC1.4 61.59,82.55 62.87,83.82 72.39,83.82 73.66,82.55 IC20.4
LOAD_ACCU  (via drill 0.6)
  Top 0.406: v93.34,68.58 93.34,59.69 IC20.16
  Bottom 0.406: IC5.11 110.49,67.31 109.22,68.58 v93.34,68.58
LOAD_ALU  (via drill 0.6)
  Top 0.406: JP1.10 124.46,12.7 v124.14,13.02 | v59.05,13.97 58.74,14.61 58.74,56.52 59.05,56.83 v59.05,64.77
  Bottom 0.406: v124.14,13.02 123.83,13.34 105.41,13.34 104.46,12.38 93.66,12.38 93.34,12.06 92.71,12.06 90.81,13.97 v59.05,13.97 | v59.05,64.77 IC1.18
LOAD_CARRY  (via drill 0.6)
  Top 0.406: v67.63,45.72 67.63,66.67 68.26,67.31 IC1.19
  Bottom 0.406: JP5.7 143.51,40.64 142.24,41.91 129.54,41.91 129.22,42.23 125.41,42.23 124.14,43.5 122.87,43.5 122.24,42.86 107.95,42.86 105.41,45.4 81.92,45.4 81.28,46.04 80.64,46.04 80.01,45.4 67.94,45.4 v67.63,45.72
LOAD_INST  (via drill 0.6)
  Top 0.406: v28.57,68.58 JP7.4
  Bottom 0.406: IC33.11 43.81,67.31 42.55,68.58 v28.57,68.58
LOAD_MEMADDR_H  (via drill 0.6)
  Top 0.406: v69.85,20.64 69.85,52.39 v69.53,52.7 | v84.45,52.7 v84.45,76.2
  Bottom 0.406: v84.45,76.2 JP9.22 | IC10.11 34.61,13.97 38.42,17.78 56.52,17.78 58.1,19.37 68.58,19.37 v69.85,20.64 | v69.53,52.7 69.85,52.39 84.14,52.39 v84.45,52.7
LOAD_PCREG0
  Bottom 0.406: IC20.13 73.66,59.69 72.39,58.42 10.79,58.42 8.26,60.96 JP4.11
LOAD_PCREG1
  Bottom 0.406: JP4.12 9.84,58.42 10.48,57.78 51.12,57.78 53.34,55.56 89.85,55.56 IC20.15
LOADREG0  (via drill 0.6)
  Top 0.406: IC10.23 38.42,36.83 38.1,37.15 38.1,64.45 v38.73,65.09
  Bottom 0.406: v38.73,65.09 39.05,65.41 52.39,65.41 53.02,64.77 IC1.11
LOADREG1  (via drill 0.6)
  Top 0.406: IC10.22 42.23,34.29 42.55,34.61 42.55,38.1 38.73,38.1 38.73,40.96 40.64,42.86 40.64,61.91 v40.96,62.23
  Bottom 0.406: v40.96,62.23 IC1.12
LOADREG2  (via drill 0.6)
  Top 0.406: v48.26,31.75 v48.26,59.69
  Bottom 0.406: v48.26,59.69 IC1.13 | IC10.21 v48.26,31.75
LOADREG3  (via drill 0.6)
  Top 0.406: v58.1,57.15 58.1,30.8 v57.78,30.48
  Bottom 0.406: v58.1,57.15 IC1.15 | v57.78,30.48 45.72,30.48 44.45,29.21 IC10.20
N$1
  Bottom 0.406: LED1.A R1.1
N$2
  Top 0.406: R2.1 134.62,67.31 133.35,68.58 125.09,68.58 124.46,69.22 124.46,79.38 123.83,80.01 IC2.2
N$3
  Top 0.406: IC2.4 123.19,74.93 123.83,74.3 123.83,65.72 124.46,65.09 136.21,65.09 137.16,66.04 R3.1
N$4
  Bottom 0.406: IC2.6 123.83,69.85 125.09,68.58 138.75,68.58 139.7,67.63 R4.1
N$5
  Top 0.406: R5.1 129.54,66.67 IC2.8
N$6
  Top 0.406: R2.2 134.62,58.74 133.67,57.78 118.11,57.78 117.47,57.15 LED2.K
N$7
  Top 0.406: R3.2 137.16,57.78 136.53,57.15 125.73,57.15 LED3.K
N$8
  Top 0.406: LED4.K 135.89,55.88 137.16,54.61 139.38,54.61 139.7,54.93 R4.2
N$9
  Top 0.406: LED5.K 138.43,60.33 138.11,60.64 132.4,60.64 132.08,60.33 R5.2
PORT_ADDR0  (via drill 0.6)
  Top 0.406: v9.84,8.89 8.89,9.84 8.89,32.38 9.53,33.02 IC35.3
  Bottom 0.406: v9.84,8.89 13.02,5.71 51.12,5.71 51.75,5.4 57.47,5.4 57.78,5.08 X2.5
PORT_ADDR1  (via drill 0.6)
  Top 0.406: v11.43,8.57 9.53,10.48 9.53,27.3 10.16,27.94 IC35.5
  Bottom 0.406: v11.43,8.57 13.65,6.35 49.21,6.35 51.12,8.26 57.47,8.26 57.78,7.94 X2.6
PORT_ADDR2  (via drill 0.6)
  Top 0.406: v13.97,7.62 13.97,22.23 13.34,22.86 IC35.7
  Bottom 0.406: v13.97,7.62 14.61,6.99 48.9,6.99 50.8,8.89 58.1,8.89 59.05,7.94 59.05,5.4 X2.7
PORT_ADDR3
  Top 0.406: IC35.9 19.05,3.81 20,2.86 61.59,2.86 61.59,5.4 X2.8
PORT_IO0  (via drill 0.6)
  Top 0.406: X2.1 52.39,4.13 50.16,6.35 v50.16,34.29
  Bottom 0.406: IC34.2 68.58,36.83 67.31,35.56 59.69,35.56 58.42,34.29 IC19.3 v50.16,34.29
PORT_IO1  (via drill 0.6)
  Top 0.406: v51.44,29.21 50.8,28.57 50.8,7.3 52.07,7.3 X2.2
  Bottom 0.406: IC34.4 68.58,31.75 67.31,30.48 59.69,30.48 58.42,29.21 IC19.5 v51.44,29.21
PORT_IO2  (via drill 0.6)
  Top 0.406: v52.07,24.13 51.44,23.5 51.44,8.26 53.66,8.26 53.98,7.94 53.98,5.4 X2.3
  Bottom 0.406: IC34.6 68.58,26.67 67.31,25.4 59.69,25.4 58.42,24.13 IC19.7 v52.07,24.13
PORT_IO3  (via drill 0.6)
  Top 0.406: v57.78,21.59 57.78,20.32 55.24,17.78 X2.4
  Bottom 0.406: v57.78,21.59 IC19.9 67.31,21.59 68.58,22.86 75.56,22.86 76.83,24.13 IC34.10
PORT_R  (via drill 0.6)
  Top 0.406: v73.66,66.04 72.71,65.09 72.71,43.18 74.3,41.59 74.3,5.71 71.44,2.86 64.14,2.86 X2.9
  Bottom 0.406: IC20.18 79.38,64.77 78.11,66.04 v73.66,66.04
PORT_W  (via drill 0.6)
  Top 0.406: v72.07,69.53 72.07,42.86 73.66,41.27 73.66,7.62 71.44,5.4 64.14,5.4 X2.10
  Bottom 0.406: IC20.19 79.38,67.31 78.11,68.58 73.03,68.58 v72.07,69.53
RAM_IO0  (via drill 0.6)
  Top 0.406: v123.51,42.55 v123.51,24.13 | v90.81,36.83 v90.81,44.45
  Bottom 0.406: JP9.1 150.81,22.86 149.54,24.13 131.76,24.13 130.49,22.86 126.05,22.86 124.78,24.13 v123.51,24.13 | v123.51,42.55 123.19,42.23 107.63,42.23 105.09,44.77 93.98,44.77 93.34,44.13 91.12,44.13 v90.81,44.45 | IC15.2 v90.81,36.83
RAM_IO1
  Bottom 0.406: IC15.4 91.44,31.75 92.71,33.02 137.79,33.02 139.06,34.29 156.84,34.29 156.84,26.04 156.21,25.4 JP9.2
RAM_IO2  (via drill 0.6)
  Top 0.406: v116.84,27.62 117.47,28.26 v117.47,30.48
  Bottom 0.406: IC15.6 91.44,26.67 92.71,27.94 114.94,27.94 115.25,27.62 v116.84,27.62 | v117.47,30.48 138.43,30.48 139.7,31.75 155.57,31.75 156.21,31.11 156.21,28.57 155.57,27.94 JP9.3
RAM_IO3  (via drill 0.6)
  Top 0.406: v117.79,25.4 117.79,20 v117.47,19.68 | v98.11,19.37 98.11,23.81 97.79,24.13 IC15.10
  Bottom 0.406: JP9.4 151.13,30.48 149.86,29.21 140.02,29.21 136.21,25.4 v117.79,25.4 | v117.47,19.68 115.89,19.68 115.57,20 114.62,20 113.67,19.05 98.42,19.05 v98.11,19.37
REGB0  (via drill 0.6)
  Top 0.406: JP9.13 152.4,53.34 151.76,52.7 151.76,36.2 151.13,35.56 151.13,9.21 v150.18,8.26 | JP1.5 v111.76,7.94
  Bottom 0.406: v150.18,8.26 149.54,7.62 112.08,7.62 v111.76,7.94
REGB1  (via drill 0.6)
  Top 0.406: JP9.14 151.45,55.88 151.13,55.56 151.13,36.51 150.5,35.88 150.5,10.16 v149.86,9.53 | JP1.6 v114.3,8.57
  Bottom 0.406: v149.86,9.53 148.59,8.26 114.62,8.26 v114.3,8.57
REGB2  (via drill 0.6)
  Top 0.406: JP9.15 150.81,58.42 150.5,58.1 150.5,36.83 149.86,36.2 149.86,11.11 v148.27,9.53 | JP1.7 v116.84,9.21
  Bottom 0.406: v148.27,9.53 147.64,8.89 117.16,8.89 v116.84,9.21
REGB3  (via drill 0.6)
  Top 0.406: JP9.16 152.4,60.96 149.86,58.42 149.86,37.15 149.22,36.51 149.22,12.06 v147.96,10.79 | JP1.8 v119.38,9.84
  Bottom 0.406: v147.96,10.79 146.69,9.53 119.38,9.53 v119.38,9.84
RESET
  Top 0.406: JP4.13 3.17,55.88 2.54,56.52 2.54,88.58 3.49,89.53 9.53,89.53 11.75,91.76 11.75,97.16 12.7,98.11 25.4,98.11 26.04,97.47 JP7.5
ROM_O0
  Bottom 0.406: IC33.2 26.67,87.63 25.4,86.36 JP4.1
ROM_O1
  Bottom 0.406: IC33.3 26.67,85.09 25.4,83.82 JP4.2
ROM_O2
  Bottom 0.406: IC33.4 26.67,82.55 25.4,81.28 JP4.3
ROM_O3
  Bottom 0.406: IC33.5 26.67,80.01 25.4,78.74 JP4.4
ROM_O4
  Bottom 0.406: IC33.6 26.67,77.47 25.4,76.2 JP4.5
ROM_O5
  Bottom 0.406: IC33.7 26.67,74.93 25.4,73.66 JP4.6
ROM_O6
  Bottom 0.406: IC33.8 26.67,72.39 25.4,71.12 JP4.7
ROM_O7
  Bottom 0.406: IC33.9 26.67,69.85 25.4,68.58 JP4.8
VCC  (via drill 0.6)
  Top 0.406: LED2.A LED3.A 127.64,53.34 | 127.64,53.34 LED4.A LED5.A | C2.1 127.64,53.34
  Top 1.016: 139.7,4.76 JP1.16 | JP5.12 142.56,27.94
  Top 1.422: IC16.16 128.91,43.5 C2.1 | C6.1 45.09,47.94 44.13,47.94
  Top 1.676: JP1.16 JP1.15 | 139.7,4.76 142.24,8.26 142.24,27.62 142.56,27.94 | JP5.12 142.24,27.94 142.24,40.01 v141.6,40.64 | IC10.24 40.64,40.96 41.91,42.23 IC24.14 44.13,47.94 44.13,77.47 43.81,77.79 43.81,89.53 44.45,90.17 IC33.20 | IC19.16 64.77,39.37 67.31,36.83 67.31,18.1 C5.1 67.63,9.84 X2.12
  Bottom 0.406: 139.7,92.71 139.38,92.39 | 8.89,41.91 6.99,41.91 R1.2
  Bottom 0.813: JP8.2 137.79,81.28 136.53,82.55 C12.1 IC2.14
  Bottom 1.016: 79.38,40.96 IC34.16 | 95.89,40.96 IC15.16 | 112.39,40.96 IC14.16 | 128.91,40.96 IC16.16 | 113.03,93.66 113.03,92.71 112.71,92.39 | IC10.24 C9.1 | 100.01,41.27 C3.1
  Bottom 1.27: JP7.6 23.5,93.34 46.99,93.34
  Bottom 1.422: 99.69,40.96 95.89,40.96 79.38,40.96 62.87,40.96 40.64,40.96 C4.1 IC35.16 | 99.69,40.96 112.39,40.96 128.59,40.96 | 128.59,40.96 128.91,40.96 | 128.59,40.96 128.91,40.64 | 46.99,94.93 C1.1 | C7.1 65.09,94.93 IC1.28 | 86.04,94.93 C8.1 | 113.03,92.71 IC5.20 | 113.03,93.66 C10.1 | 91.44,92.39 IC20.28 | 99.69,40.96 100.01,41.27
  Bottom 1.676: 40.64,40.96 IC10.24 | 62.87,40.96 IC19.16 | C4.1 9.84,40.96 8.89,41.91 8.89,53.34 JP4.14 | 128.91,40.64 v141.6,40.64 | IC33.20 46.99,93.34 46.99,94.93 65.09,94.93 86.04,94.93 88.9,94.93 91.44,92.39 112.71,92.39 | 124.46,92.71 JP6.2 | 113.03,92.71 124.46,92.71 | JP8.2 147,85.41 142.56,89.85 | 124.46,92.71 C11.+ 139.7,92.71 142.56,89.85 | X2.12 X2.11 | 142.56,89.85 D1.C
ZERO_IN
  Bottom 0.406: IC16.13 137.79,31.75 139.06,33.02 JP5.10

### Text on the board
tNames: GND | VCC | clock board | accumulator | microcode 1 | microcode 2 | A0 | A1 | A2 | A3 | ROM board | 4BC 4 bit TTL CPU (c) 2018 SP | RAM board | jump logic board | power | I/O port | ALU output | ALU input | C:/Users/svpet/Pictures/ham_black_mono.bmp | C:/Users/svpet/Pictures/ham_black_mono.bmp